# Altium project HU_MAIN_PCB_revA.PrjPcb
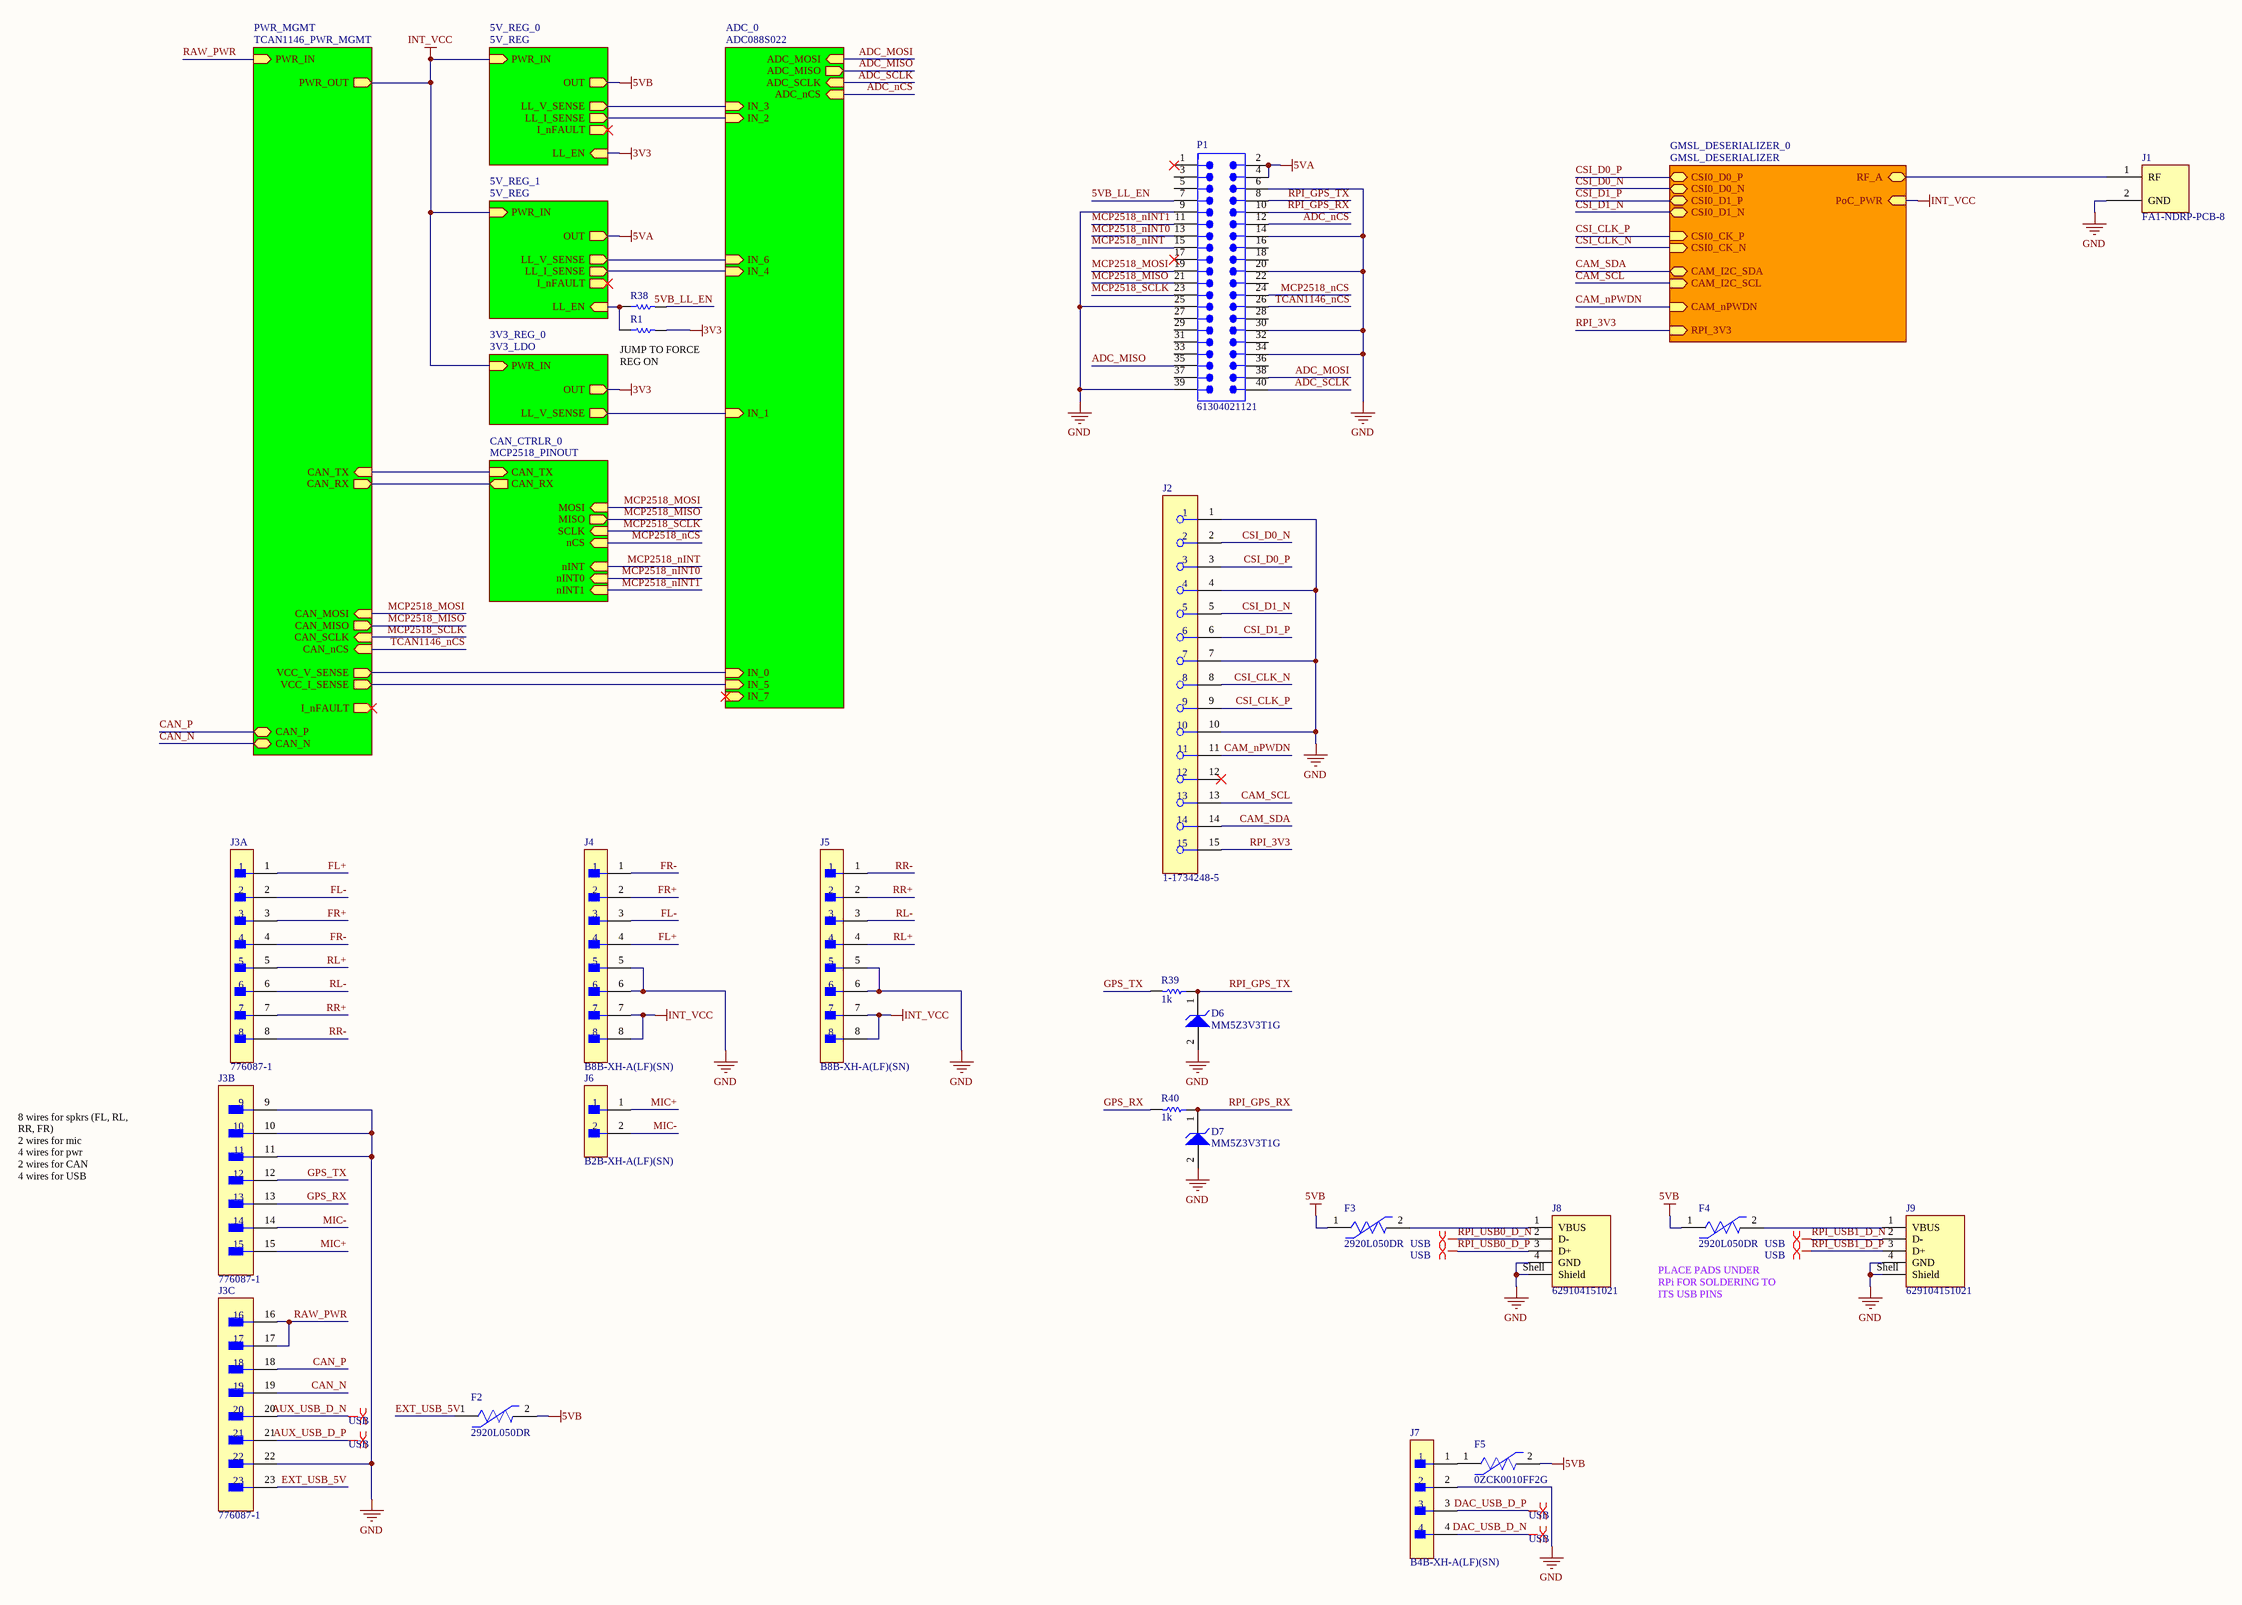
[diagram p0: HU_MAIN_PCB_revA.SchDoc]
6 sheets, 113 parts. Net scope: hierarchical (ports join the sheet entries above them; power ports are global).
Board file: HU_MAIN_PCB_revA.PcbDoc
Sheets:
  HU_MAIN_PCB_revA.SchDoc
    PWR_MGMT = TCAN1146_PWR_MGMT.SchDoc
    5V_REG_0 = 5V_REG.SchDoc
    5V_REG_1 = 5V_REG.SchDoc
    CAN_CTRLR_0 = MCP2518_PINOUT.SchDoc
    ADC_0 = ADC088S022.SchDoc
    3V3_REG_0 = 3V3_LDO.SchDoc

## Sheet HU_MAIN_PCB_revA.SchDoc
size C; SheetNumber: 1; SheetTotal: 7

### Parts
D6  MM5Z3V3T1G  [ONSC-SOD-523-2-502-01_V]
D7  MM5Z3V3T1G  [ONSC-SOD-523-2-502-01_V]
F2  2920L050DR  [FP-2920L050DR-MFG]
F3  2920L050DR  [FP-2920L050DR-MFG]
F4  2920L050DR  [FP-2920L050DR-MFG]
F5  0ZCK0010FF2G  [FP-0ZCK0010FF2G-MFG]
J1  FA1-NDRP-PCB-8  [FA1-NDRP-PCB-8-Footprint-1]
J2  1-1734248-5  [FP-1-1734248-5-MFG]
J3  776087-1  [FP-776087-1-MFG]  (parts A,B,C of 3)
J4  B8B-XH-A(LF)(SN)  [FP-B8B-XH-A_LF_SN-MFG]
J5  B8B-XH-A(LF)(SN)  [FP-B8B-XH-A_LF_SN-MFG]
J6  B2B-XH-A(LF)(SN)  [FP-B2B-XH-A_LF_SN-MFG]
J7  B4B-XH-A(LF)(SN)  [FP-B4B-XH-A_LF_SN-MFG]
J8  629104151021  [629104151021]
J9  629104151021  [629104151021]
P1  61304021121  [61304021121]
R1  DNP  [RESC1005X40X25ML05T05]  (value not drawn)
R38  DNP  [RESC1005X40X25ML05T05]  (value not drawn)
R39  1k  [R0603B]
R40  1k  [R0603B]

### Sub-sheets
3V3_REG_0 = 3V3_LDO: PWR_IN (in), OUT (out), LL_V_SENSE (out)
5V_REG_0 = 5V_REG: PWR_IN (in), LL_EN (in), OUT (out), LL_V_SENSE (out), LL_I_SENSE (out), I_nFAULT (out)
5V_REG_1 = 5V_REG: PWR_IN (in), LL_EN (in), OUT (out), LL_V_SENSE (out), LL_I_SENSE (out), I_nFAULT (out)
ADC_0 = ADC088S022: ADC_MOSI (in), ADC_MISO (out), ADC_SCLK (in), ADC_nCS (in), IN_0 (in), IN_1 (in), IN_2 (in), IN_3 (in), IN_4 (in), IN_5 (in), IN_6 (in), IN_7 (in)
CAN_CTRLR_0 = MCP2518_PINOUT: CAN_TX (in), CAN_RX (out), MOSI (in), MISO (out), SCLK (in), nCS (in), nINT (in), nINT0 (in), nINT1 (in)
GMSL_DESERIALIZER_0 = GMSL_DESERIALIZER (file not in this document): CSI0_D0_P (bidir), CSI0_D0_N (bidir), CSI0_D1_P (bidir), CSI0_D1_N (bidir), CSI0_CK_P (in), CSI0_CK_N (in), CAM_I2C_SDA (bidir), CAM_I2C_SCL (in), PoC_PWR (in), CAM_nPWDN (in), RF_A (bidir), RPI_3V3 (in)
PWR_MGMT = TCAN1146_PWR_MGMT: PWR_IN (in), PWR_OUT (out), CAN_SCLK (in), CAN_MISO (out), CAN_MOSI (in), CAN_nCS (in), VCC_V_SENSE (out), VCC_I_SENSE (out), I_nFAULT (out), CAN_P (bidir), CAN_N (bidir), CAN_TX (in), CAN_RX (out)

### Nets
3V3: R1.2 ; sheet 5V_REG_0/LL_EN, sheet 3V3_REG_0/OUT
5VA: P1.2 P1.4 ; sheet 5V_REG_1/OUT
5VB: F2.2 F3.1 F4.1 F5.2 ; sheet 5V_REG_0/OUT
GND: D6.2(A) D7.2(A) J1.2(GND) J2.1 J2.4 J2.7 J2.10 J3.9 J3.10 J3.11 J3.22 J4.5 J4.6 J5.5 J5.6 J7.2 J8.4(GND) J8.Shell(Shield) J9.4(GND) J9.Shell(Shield) P1.6 P1.9 P1.14 P1.20 P1.25 P1.30 P1.34 P1.39
INT_VCC: J4.7 J4.8 J5.7 J5.8 ; sheet PWR_MGMT/PWR_OUT, sheet 5V_REG_0/PWR_IN, sheet 5V_REG_1/PWR_IN, sheet GMSL_DESERIALIZER_0/PoC_PWR, sheet 3V3_REG_0/PWR_IN
5VB_LL_EN: P1.7 R38.2
ADC_MISO: P1.35 ; sheet ADC_0/ADC_MISO
ADC_MOSI: P1.38 ; sheet ADC_0/ADC_MOSI
ADC_nCS: P1.12 ; sheet ADC_0/ADC_nCS
ADC_SCLK: P1.40 ; sheet ADC_0/ADC_SCLK
AUX_USB_D_N: J3.20
AUX_USB_D_P: J3.21
CAM_nPWDN: J2.11 ; sheet GMSL_DESERIALIZER_0/CAM_nPWDN
CAM_SCL: J2.13 ; sheet GMSL_DESERIALIZER_0/CAM_I2C_SCL
CAM_SDA: J2.14 ; sheet GMSL_DESERIALIZER_0/CAM_I2C_SDA
CAN_N: J3.19 ; sheet PWR_MGMT/CAN_N
CAN_P: J3.18 ; sheet PWR_MGMT/CAN_P
CAN_RX: sheet PWR_MGMT/CAN_RX, sheet CAN_CTRLR_0/CAN_RX
CAN_TX: sheet PWR_MGMT/CAN_TX, sheet CAN_CTRLR_0/CAN_TX
CSI_CLK_N: J2.8 ; sheet GMSL_DESERIALIZER_0/CSI0_CK_N
CSI_CLK_P: J2.9 ; sheet GMSL_DESERIALIZER_0/CSI0_CK_P
CSI_D0_N: J2.2 ; sheet GMSL_DESERIALIZER_0/CSI0_D0_N
CSI_D0_P: J2.3 ; sheet GMSL_DESERIALIZER_0/CSI0_D0_P
CSI_D1_N: J2.5 ; sheet GMSL_DESERIALIZER_0/CSI0_D1_N
CSI_D1_P: J2.6 ; sheet GMSL_DESERIALIZER_0/CSI0_D1_P
DAC_USB_D_N: J7.4
DAC_USB_D_P: J7.3
EXT_USB_5V: F2.1 J3.23
FL+: J3.1 J4.4
FL-: J3.2 J4.3
FR+: J3.3 J4.2
FR-: J3.4 J4.1
GPS_RX: J3.13 R40.2
GPS_TX: J3.12 R39.2
MCP2518_MISO: P1.21 ; sheet PWR_MGMT/CAN_MISO, sheet CAN_CTRLR_0/MISO  [project net CAN_MISO]
MCP2518_MOSI: P1.19 ; sheet PWR_MGMT/CAN_MOSI, sheet CAN_CTRLR_0/MOSI  [project net CAN_MOSI]
MCP2518_nCS: P1.24 ; sheet CAN_CTRLR_0/nCS
MCP2518_nINT: P1.15 ; sheet CAN_CTRLR_0/nINT
MCP2518_nINT0: P1.13 ; sheet CAN_CTRLR_0/nINT0
MCP2518_nINT1: P1.11 ; sheet CAN_CTRLR_0/nINT1
MCP2518_SCLK: P1.23 ; sheet PWR_MGMT/CAN_SCLK, sheet CAN_CTRLR_0/SCLK  [project net CAN_SCLK]
MIC+: J3.15 J6.1
MIC-: J3.14 J6.2
RAW_PWR: J3.16 J3.17 ; sheet PWR_MGMT/PWR_IN
RL+: J3.5 J5.4
RL-: J3.6 J5.3
RPI_3V3: J2.15 ; sheet GMSL_DESERIALIZER_0/RPI_3V3
RPI_GPS_RX: D7.1(K) P1.10 R40.1
RPI_GPS_TX: D6.1(K) P1.8 R39.1
RPI_USB0_D_N: J8.2(D-)
RPI_USB0_D_P: J8.3(D+)
RPI_USB1_D_N: J9.2(D-)
RPI_USB1_D_P: J9.3(D+)
RR+: J3.7 J5.2
RR-: J3.8 J5.1
TCAN1146_nCS: P1.26 ; sheet PWR_MGMT/CAN_nCS  [project net CAN_nCS]
NetF3_2: F3.2 J8.1(VBUS)
NetF4_2: F4.2 J9.1(VBUS)
NetF5_1: F5.1 J7.1
NetJ1_1: J1.1(RF) ; sheet GMSL_DESERIALIZER_0/RF_A
NetR1_1: R1.1 R38.1 ; sheet 5V_REG_1/LL_EN
NetR4_5V_REG_0_1: sheet 5V_REG_0/LL_V_SENSE, sheet ADC_0/IN_3
NetR4_5V_REG_1_1: sheet 5V_REG_1/LL_V_SENSE, sheet ADC_0/IN_6
NetR27_1: sheet PWR_MGMT/VCC_V_SENSE, sheet ADC_0/IN_0
NetR36_1: sheet ADC_0/IN_1, sheet 3V3_REG_0/LL_V_SENSE
NetU2_5V_REG_0_7: sheet 5V_REG_0/LL_I_SENSE, sheet ADC_0/IN_2
NetU2_5V_REG_1_7: sheet 5V_REG_1/LL_I_SENSE, sheet ADC_0/IN_4
NetU7_7: sheet PWR_MGMT/VCC_I_SENSE, sheet ADC_0/IN_5

Not connected (* = marked no-connect by the designer): J2 12*; P1 1* 3 5 16 17* 18 22 27 28 29 31 32 33 36 37

### Layout directives
differential pair; differential pair class USB: AUX_USB_D_N, AUX_USB_D_P, DAC_USB_D_N, DAC_USB_D_P, RPI_USB0_D_N, RPI_USB0_D_P, RPI_USB1_D_N, RPI_USB1_D_P

### Notes on the sheet
- (near R1) JUMP TO FORCE REG ON
- 8 wires for spkrs (FL, RL, RR, FR)
  2 wires for mic
  4 wires for pwr
  2 wires for CAN
  4 wires for USB
- (near F4) PLACE PADS UNDER RPi FOR SOLDERING TO ITS USB PINS

### Library data of the parts
D6 D7 = CMP-1060-00750-1: Zener Voltage Regulator, 500 mW, 2-Pin SOD-523, Pb-Free, Tape and Reel; Manufacturer: On Semiconductor; P Max (W): 0.5; VZ Typ (V): 3.3; RoHS: Pb-Free; ComponentLink2Description: Datasheet; PackageReference: SOD-523-2-502-01; DatasheetVersion: Rev. 10; ComponentLink1Description: Manufacturer URL; PackageVersion: Rev. E, 09/2010; ComponentLink3URL: http://www.onsemi.com/pub_link/Collateral/502-01.PDF; ComponentLink2URL: http://www.onsemi.cn/pub_link/Collateral/MM5Z2V4T1-D.PDF; Mounting Technology: Surface Mount; PartNumber: MM5Z3V3T1G; Packing: Tape and Reel; PackageDescription: 2-Pin SOD, Body 1.2 x 0.8 mm; ComponentLink1URL: http://www.onsemi.com/; ComponentLink3Description: Package Specification
F2-F4 = CMP-08606-000071-1: PTC RESET FUSE 60V 500MA 2920; Resistance: 1.4R; Trip Current: 1A; Power Dissipation: 1.5W; Time to Trip: 4s; Approvals: cULus; Current Rating: 10A; Operating Supply Voltage: 60V; Termination: SMD/SMT; Width: 5.44mm; Case/Package: 2920; Series: 2920L; Case Code (Imperial): 2920; Height: 1.25mm; Hold Current: 500mA; Terminal Material: Copper; Min Operating Temperature: -40°C; Package Quantity: 1500; Max Voltage Rating (DC): 60V; RoHS Compliant: Yes; Case Code (Metric): 7351; Lead Free: Lead Free; Max Operating Temperature: 85°C; Voltage Rating (DC): 60V; Working Voltage: 60V; Length: 7.98mm; REACH SVHC: No SVHC; Max Current Rating: 10A; Voltage Rating: 60V; Packaging: Tape and Reel
F5 = CMP-16043-000017-1: PTC RESET FUSE 15V 100MA 0805; Max Current Rating: 100A; Trip Current: 300mA; Time to Trip: 1.5s; Lead Free: Lead Free; Case/Package: 0805; Package Quantity: 1; Hold Current: 100mA; Case Code (Metric): 2012; Packaging: Tape and Reel; Case Code (Imperial): 0805; RoHS Compliant: Yes
J1 = CMP-002-00054-1: RF F Connector, Male, Board Mount, Solder Terminal, Plug; Connector Type: RF F CONNECTOR; RoHS Compliant: Yes; Mounting Technology: Board
J2 = CMP-03368-000001-1: CONN FPC VERT 15POS 1.00MM SMD; Manufacturer: TE; Conn Orientation: Vertical; Conn Gender: Female; Current Rating: 1A; Is Female: yes; Number Of Contacts: 15; Pitch: 1mm; Voltage Rating: 125V; ComponentLink2URL: https://www.te.com/commerce/DocumentDelivery/DDEController?Action=showdoc&DocId=Customer+Drawing%7F1734248%7FE1%7Fpdf%7FEnglish%7FENG_CD_1734248_E1__.pdf%7F1-1734248-5; Device Class L1: Connectors; Category: Conn; Package: 0; Lead Free: Yes; Digikey Description: CONN FPC VERT 15POS 1.00MM SMD; Height: 8mm; Manufacturer Part Number: 1-1734248-5; Temperature: -20°C to +85°C; Contact Material: Gold,Nickel; Device Class L3: unset; ComponentLink2Description: Datasheet; RoHS: TRUE; Temperature Range Low: -20°C; Octopart: https://octopart.com/1-1734248-5-te+connectivity-40620898; Device Class L2: FFC / FPC; Mouser Description: FFC & FPC Connectors 15P 1.0 FPC, Zip V/T SMT; Automotive: No; Temperature Range High: +85°C; Mounting Type: Surface Mount
J3 = CMP-03369-000157-2: CONN HEADER R/A 23POS 4MM; Max Voltage Rating (AC): 250V; PCB Thickness: 0.062inch; PCB Mount Alignment: Yes (With); Primary Type: Rectangular; Number of Signal Positions: 23; Row Spacing: 0.157inch; Current Rating: 17A; Connector System: Wire-to-Device; Number of Ports: 1; Shielding: Unshielded; PCB Mount Retention: With; Circuit Application: Power; Tab Thickness: 1.3mm; Gender: Male; Contact Shape: Circular; Mount: Through Hole; ELV: Compliant; Orientation: Right Angle; Lead Free: Lead Free; Contact Plating: Tin; Package Quantity: 1; RoHS Compliant: Yes; Connector Type: Header; Series: Ampseal; Termination: Solder; Voltage Rating (AC): 250V; Contact Material: Brass; Number of Rows: 3; Depth: 37.9mm; Housing Material: Polybutylene; Fastening Type: Ramp; Width: 37.9mm; Flammability Rating: UL94 V-0; Housing Color: Black; Radiation Hardening: No; Contact Type: Male Pin; Sealable: Yes (With); Length: 60.8mm; Max Operating Temperature: 221°C; Packaging: Bulk; Number of Positions: 23; Insulation Material: PBT; Pitch: 0.157inch; Contact Finish - Mating: TIN; Color: Black; Number of Terminals/Pins: 23; Insulation Color: Black; Number of Contacts: 23; Min Operating Temperature: -40°C
J4 J5 = CMP-17438-000015-1: CONN HEADER VERT 8POS 2.5MM; Voltage Rating (AC): 250V; Insulation Resistance: 1GR; Connector Type: Male Pin; Max Current Rating: 3A; Wire/Cable Gauge: 22AWG; Number of Contacts: 8; Contact Resistance: 20mR; Orientation: Straight; Pitch: 2.5mm; Min Operating Temperature: -25°C; Number of Rows: 1; Contact Type: Male Pin; Packaging: Bulk; Lead Free: Lead Free; Max Operating Temperature: 85°C; Housing Material: Polyamide; Voltage Rating: 250V; Series: XH; Mount: Through Hole; Depth: 5.75mm; Contact Material: Brass; Fastening Type: Detent; Color: Natural; Max Voltage Rating (AC): 250V; Number of Positions: 8; Housing Color: White; Contact Plating: Tin; Lead Pitch: 2.5mm; Length: 22.4mm; REACH SVHC: No SVHC; Termination: Press-Fit; Current Rating: 3A
J6 = CMP-2000-05888-3: CONN HEADER VERT 2POS 2.5MM; Current Rating: 3A; Voltage Rating: 250V; Number of Contacts: 2; Contact Resistance: 20mR; Wire/Cable Gauge: 22AWG; Insulation Resistance: 1GR; Connector Type: Male Pin; Packaging: Bulk; Contact Material: Brass; Lead Free: Lead Free; Orientation: Straight; Contact Plating: Tin; Max Current Rating: 3A; Termination: Solder; Fastening Type: Detent; Depth: 5.75mm; Housing Material: Polyamide; REACH SVHC: No SVHC; Series: XH; Voltage Rating (AC): 250V; Number of Positions: 2; Color: Natural; Contact Type: Male Pin; Max Voltage Rating (DC): 250V; Pitch: 2.5mm; Lead Pitch: 2.5mm; Mount: Through Hole; Max Operating Temperature: 85°C; Length: 7.4mm; Max Voltage Rating (AC): 250V; Min Operating Temperature: -25°C; Number of Rows: 1; Housing Color: White
J7 = CMP-17439-000250-1: CONN HEADER VERT 4POS 2.5MM; Number of Contacts: 4; Contact Resistance: 20mR; Voltage Rating: 250V; Max Current Rating: 3A; Gender: Male; Wire/Cable Gauge: 22AWG; Mated Stacking Heights: 9.8mm; Insulation Resistance: 1GR; Orientation: Straight; Contact Type: Male Pin; Contact Finish - Mating: TIN; Series: XH; Max Voltage Rating (AC): 250V; Lead Pitch: 2.5mm; Contact Shape: Square; Insulation Color: Natural; Termination: Solder; Lead Free: Lead Free; Voltage Rating (AC): 250V; Number of Rows: 1; Flammability Rating: UL94 V-0; Number of Positions: 4; Max Operating Temperature: 85°C; Package Quantity: 500; Mount: Through Hole; REACH SVHC: No SVHC; Connector Type: Header; Insulation Material: Nylon; Fastening Type: Detent; Min Operating Temperature: -25°C; Housing Color: White; Packaging: Bulk; Contact Plating: Tin; Contact Material: Brass; Max Voltage Rating (DC): 250V; Housing Material: Polyamide; Color: Natural; Material: Polyamide; Pitch: 2.5mm; Depth: 5.75mm; Current Rating: 3A; Length: 12.4mm
J8 J9 = CMP-1502-03241-3: NexarPartId: 52645112; USB Standard: USB 2.0; Insulation Resistance: 1GΩ; Current Rating: 1.5A; Number of Contacts: 4; Contact Resistance: 30mΩ; Gender: Receptacle; Connector Type: USB; Operating Supply Voltage: 30V; Mount: Horizontal, Surface Mount; RoHS: Compliant; Max Operating Temperature: 85°C; Min Operating Temperature: -40°C; Contact Plating: Gold; Contact Material: Gold, Nickel; Number of Pins: 4; Packaging: Tape and Reel; Height: 7.2mm; Orientation: Horizontal; Voltage Rating: 30V; Termination: SMD/SMT; Features: Shielded; REACH SVHC: Unknown
P1 = CMP-1502-01135-3: NexarPartId: 32855579; Pitch: 2.54mm; Operating Supply Voltage: 250V; Gender: Male; Number of Positions: 40; Current Rating: 3A; Contact Resistance: 20mΩ; Connector Type: Male Pin; Color: Black; Contact Plating: Gold; Contact Material: Copper; Number of Rows: 2; Row Spacing: 2.54mm; Mount: Through Hole; RoHS: Compliant; Contact Mating Length: 5.9944mm; Voltage Rating: 250V; Orientation: Vertical; Max Operating Temperature: 105°C; REACH SVHC: Unknown; Min Operating Temperature: -40°C; Lead Pitch: 2.54mm; Height: 8.89mm; Termination: Solder; Number of Pins: 40; Number of Contacts: 40; Packaging: Bulk
R1 R38 = CMP-009-00118-2: READ THE NAME; Pins: 2; Component Type: Standard; Design Item ID: CMP-009-00206-2; Source: 0402jump.SchLib
R39 R40 = CMP-009-00002-14: Resistor

## Sheet TCAN1146_PWR_MGMT.SchDoc
size C; SheetNumber: 5; SheetTotal: 7
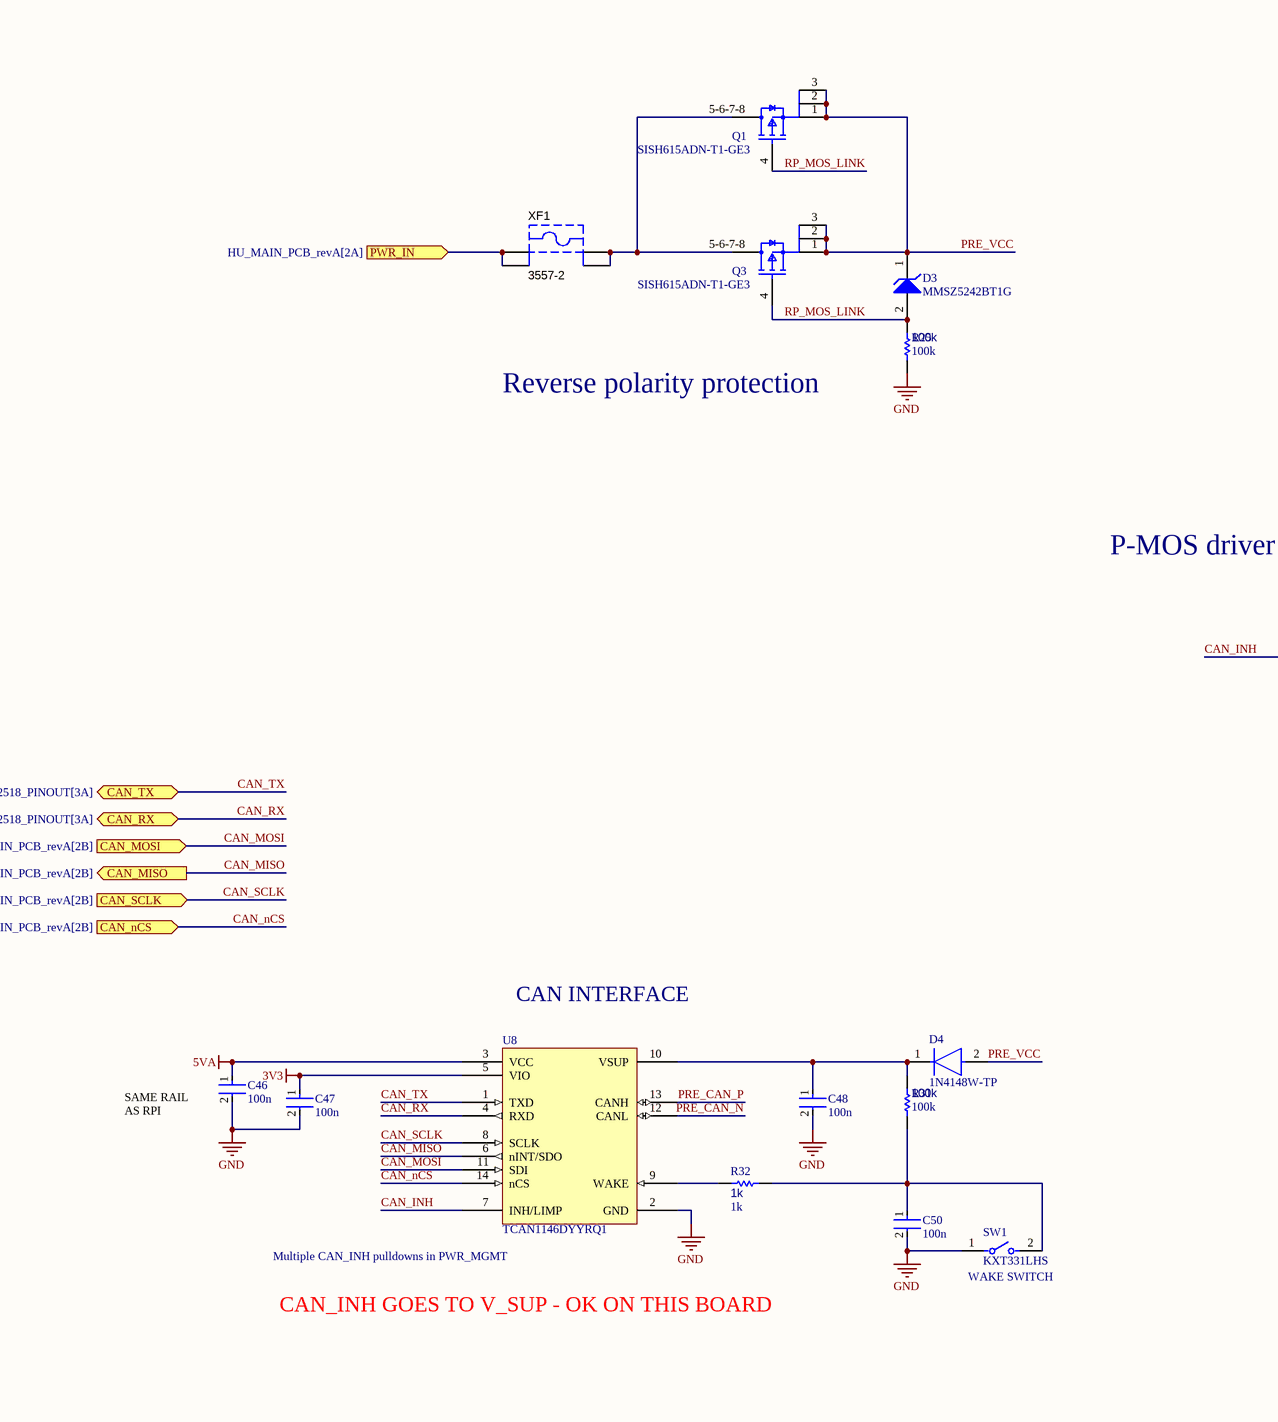
[diagram p1: TCAN1146_PWR_MGMT.SchDoc, left]
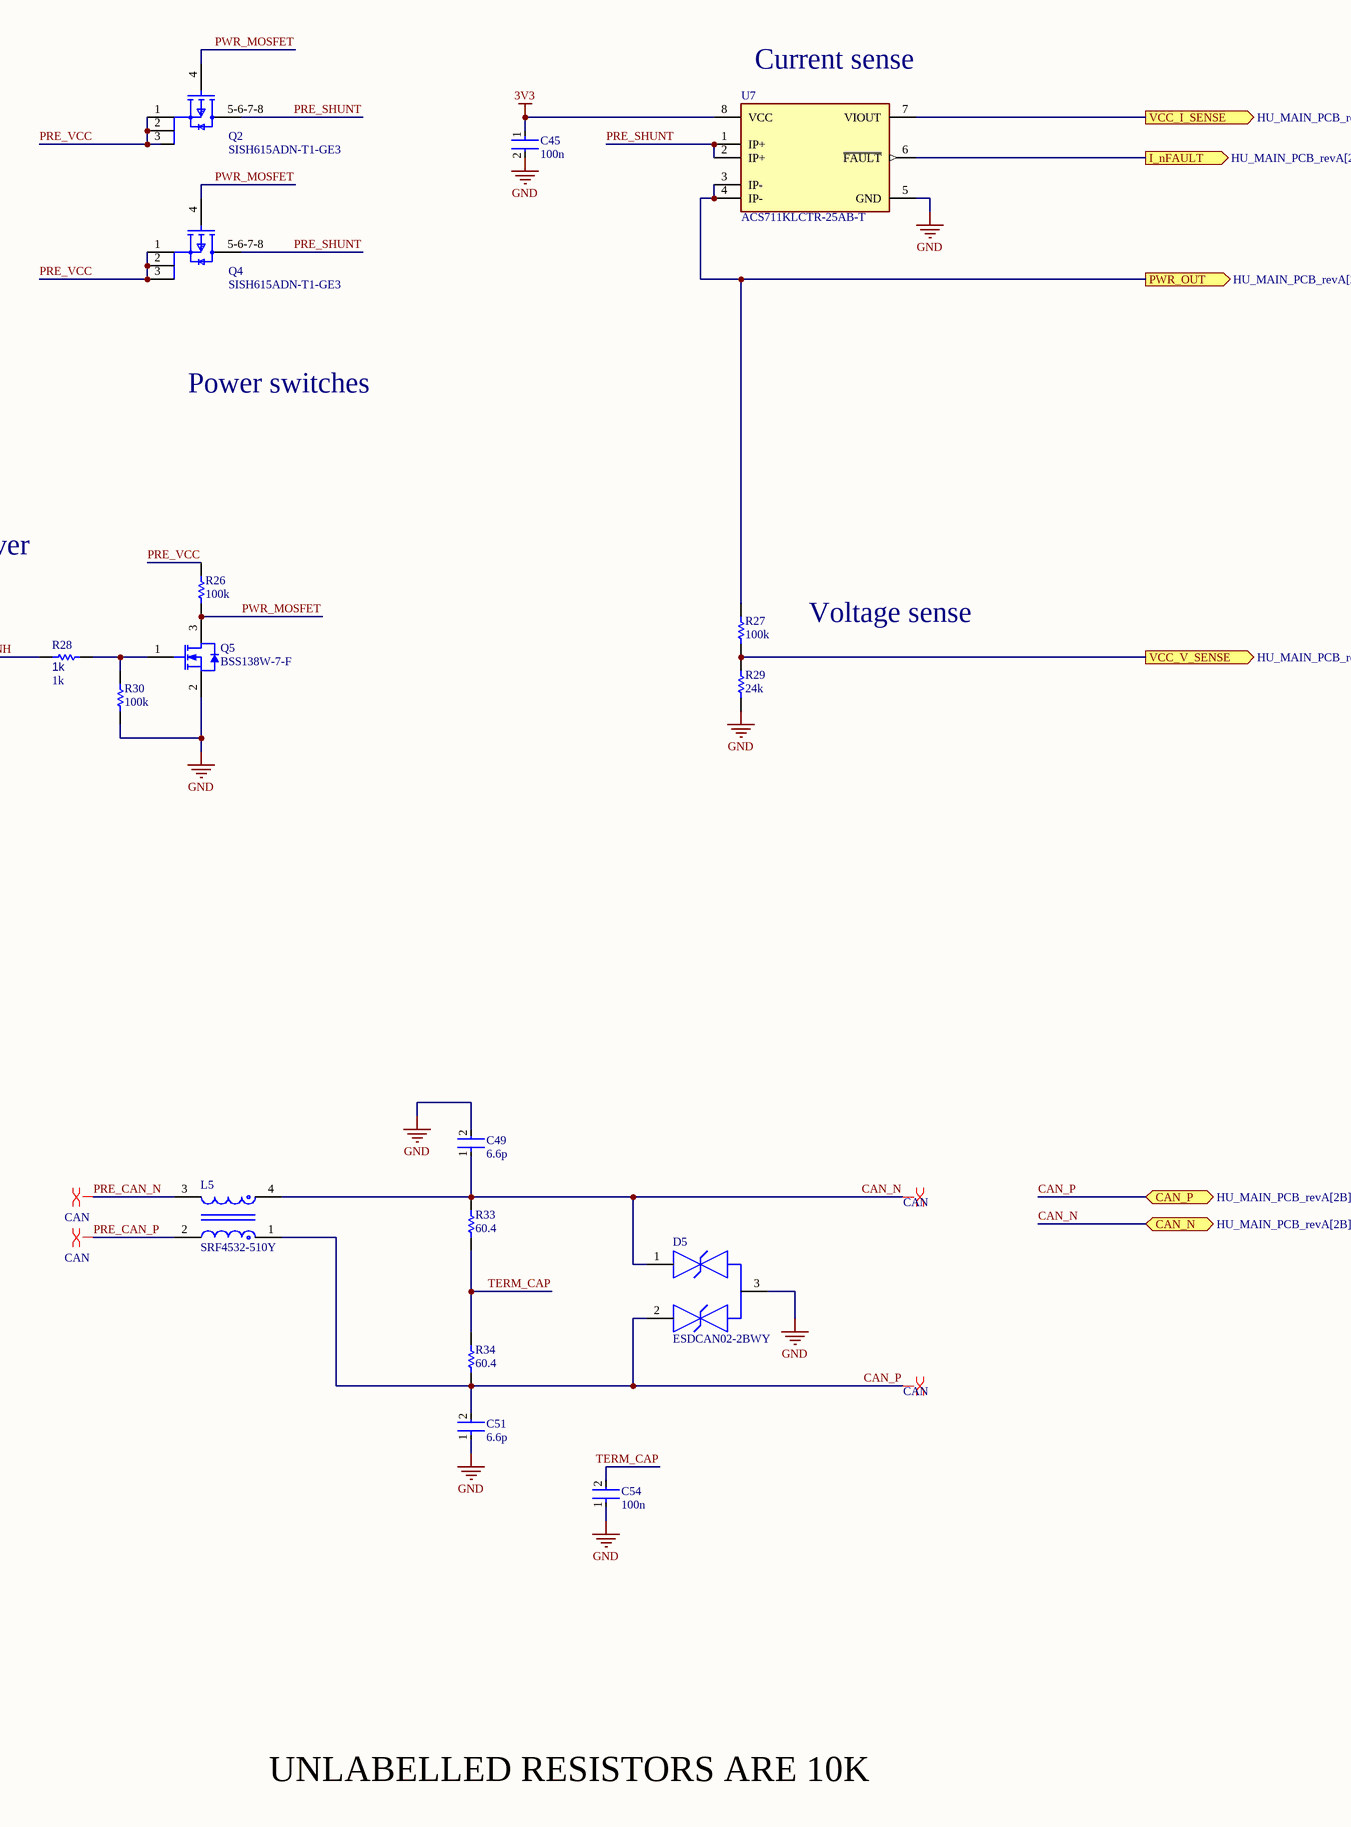
[diagram p2: TCAN1146_PWR_MGMT.SchDoc, right]

### Parts
C45  100n  [FP-0402-L_1_0_0_05-W_0_5-IPC_A]
C46  100n  [FP-0402-L_1_0_0_05-W_0_5-IPC_A]
C47  100n  [FP-0402-L_1_0_0_05-W_0_5-IPC_A]
C48  100n  [FP-0402-L_1_0_0_05-W_0_5-IPC_A]
C49  6.6p  [FP-0402-L_1_0_0_05-W_0_5-IPC_A]
C50  100n  [FP-0402-L_1_0_0_05-W_0_5-IPC_A]
C51  6.6p  [FP-0402-L_1_0_0_05-W_0_5-IPC_A]
C54  100n  [FP-0402-L_1_0_0_05-W_0_5-IPC_A]
D3  MMSZ5242BT1G  [ONSC-SOD-123-2-425-04_V]
D4  1N4148W-TP  [FP-SOD-123-IPC_A]
D5  ESDCAN02-2BWY  [FP-SOT323-3L-MFG]
L5  SRF4532-510Y  [FP-SRF4532-MFG]
Q1  SISH615ADN-T1-GE3  [SISH615ADN-T1-GE3-Footprint-1]
Q2  SISH615ADN-T1-GE3  [SISH615ADN-T1-GE3-Footprint-1]
Q3  SISH615ADN-T1-GE3  [SISH615ADN-T1-GE3-Footprint-1]
Q4  SISH615ADN-T1-GE3  [SISH615ADN-T1-GE3-Footprint-1]
Q5  BSS138W-7-F  [DIOD-SOT323-3_V]
R25  100k  [R0603B]
R26  100k  [R0603B]
R27  100k  [R0603B]
R28  1k  [R0603B]
R29  24k  [R0603B]
R30  100k  [R0603B]
R31  100k  [R0603B]
R32  1k  [R0603B]
R33  60.4  [R0603B]
R34  60.4  [R0603B]
SW1  KXT331LHS  [FP-KXT331LHS-MFG]
U7  ACS711KLCTR-25AB-T  [FP-LC-8-IPC_A]
U8  TCAN1146DYYRQ1  [TCAN1146DYYRQ1-Footprint-1]
XF1  3557-2  [KSTN-3557-2]

### Ports
CAN_MISO (out, see HU_MAIN_PCB_revA[2B]), CAN_MOSI (in, see HU_MAIN_PCB_revA[2B]), CAN_N (bidir, see HU_MAIN_PCB_revA[2B]), CAN_nCS (in, see HU_MAIN_PCB_revA[2B]), CAN_P (bidir, see HU_MAIN_PCB_revA[2B]), CAN_RX (bidir, see HU_MAIN_PCB_revA[2B], MCP2518_PINOUT[3A]), CAN_SCLK (in, see HU_MAIN_PCB_revA[2B]), CAN_TX (bidir, see HU_MAIN_PCB_revA[2B], MCP2518_PINOUT[3A]), I_nFAULT (out, see HU_MAIN_PCB_revA[2B]), PWR_IN (in, see HU_MAIN_PCB_revA[2A]), PWR_OUT (out, see HU_MAIN_PCB_revA[2A]), VCC_I_SENSE (out, see HU_MAIN_PCB_revA[2B]), VCC_V_SENSE (out, see HU_MAIN_PCB_revA[2B])

### Nets
3V3: C45.1 C47.1 U7.8(VCC) U8.5(VIO)
5VA: C46.1 U8.3(VCC)
GND: C45.2 C46.2 C47.2 C48.2 C49.2 C50.2 C51.1 C54.1 D5.3 Q5.2(S) R25.1 R29.1 R30.1 SW1.1 U7.5(GND) U8.2(GND)
INT_VCC: R27.2 U7.3(IP-) U7.4(IP-) ; port PWR_OUT
CAN_INH: R28.1 U8.7(INH/LIMP)
CAN_MISO: U8.6(nINT/SDO) ; port CAN_MISO
CAN_MOSI: U8.11(SDI) ; port CAN_MOSI
CAN_N: C49.1 D5.1 L5.4 R33.2 ; port CAN_N
CAN_nCS: U8.14(nCS) ; port CAN_nCS
CAN_P: C51.2 D5.2 L5.1 R34.1 ; port CAN_P
CAN_RX: U8.4(RXD) ; port CAN_RX
CAN_SCLK: U8.8(SCLK) ; port CAN_SCLK
CAN_TX: U8.1(TXD) ; port CAN_TX
PRE_CAN_N: L5.3 U8.12(CANL)
PRE_CAN_P: L5.2 U8.13(CANH)
PRE_SHUNT: Q2.5-6-7-8(D) Q4.5-6-7-8(D) U7.1(IP+) U7.2(IP+)
PRE_VCC: D3.1(K) D4.2(A) Q1.1(S) Q1.2(S) Q1.3(S) Q2.1(S) Q2.2(S) Q2.3(S) Q3.1(S) Q3.2(S) Q3.3(S) Q4.1(S) Q4.2(S) Q4.3(S) R26.2
PWR_MOSFET: Q2.4(G) Q4.4(G) Q5.3(D) R26.1
RAW_PWR: XF1.1 XF1.2 ; port PWR_IN
RP_MOS_LINK: D3.2(A) Q1.4(G) Q3.4(G) R25.2
TERM_CAP: C54.2 R33.1 R34.2
NetC48_1: C48.1 D4.1(C) R31.2 U8.10(VSUP)
NetC50_1: C50.1 R31.1 R32.2 SW1.2
NetQ1_5-6-7-8: Q1.5-6-7-8(D) Q3.5-6-7-8(D) XF1.3 XF1.4
NetQ5_1: Q5.1(G) R28.2 R30.2
NetR27_1: R27.1 R29.2 ; port VCC_V_SENSE
NetR32_1: R32.1 U8.9(WAKE)
NetU7_6: U7.6(~{FAULT}) ; port I_nFAULT
NetU7_7: U7.7(VIOUT) ; port VCC_I_SENSE

### Layout directives
differential pair; differential pair class CAN: CAN_N, CAN_P, PRE_CAN_N, PRE_CAN_P

### Notes on the sheet
- (near U7) Current sense
- (near R25) Reverse polarity protection
- Power switches
- P-MOS driver
- Voltage sense
- CAN INTERFACE
- (near C46) SAME RAIL AS RPI
- (near U8) Multiple CAN_INH pulldowns in PWR_MGMT
- (near SW1) WAKE SWITCH
- CAN_INH GOES TO V_SUP - OK ON THIS BOARD
- UNLABELLED RESISTORS ARE 10K

### Library data of the parts
C45-C51 C54 = CMP-001-00058-1: LARGE PADS, 0402 CAP, CHANGE COMMENT TO MATCH REAL P/N; Capacitor Type: Ceramic; Min Operating Temperature: -55°C; Mounting Technology: Surface Mount; Pins: 2; Case/Package: 0402; RoHS Compliant: Yes; Max Operating Temperature: 85°C
D3 = CMP-1060-00565-1: Zener Voltage Regulator, 500 mW, 2-Pin SOD-123, Pb-Free, Tape and Reel; Manufacturer: On Semiconductor; P Max (W): 0.5; VZ Typ (V): 12; PartNumber: MMSZ5242BT1G; PackageReference: SOD-123-2-425-04; ComponentLink3URL: http://www.onsemi.com/pub_link/Collateral/425-04.PDF; Mounting Technology: Surface Mount; ComponentLink2Description: Datasheet; ComponentLink1URL: http://www.onsemi.com/; ComponentLink3Description: Package Specification; PackageDescription: 2-Pin SOD, Body 1.6 x 2.69 mm; PackageVersion: Rev. G, 10/2009; ComponentLink1Description: Manufacturer URL; RoHS: Pb-Free; ComponentLink2URL: http://www.onsemi.com/pub_link/Collateral/MMSZ5221BT1-D.PDF; Packing: Tape and Reel; DatasheetVersion: Rev. 12
D4 = CMP-2000-04993-2: DIODE GEN PURP 100V 150MA SOD123; Max Reverse Leakage Current: 5uA; Max Surge Current: 2A; Reverse Recovery Time: 4ns; Polarity: Standard; Capacitance: 4pF; Max Forward Surge Current (Ifsm): 1A; Element Configuration: Single; Power Dissipation: 400mW; Forward Voltage: 1V; Radiation Hardening: No; Lead Free: Lead Free; Max Reverse Voltage (DC): 100V; Current Rating: 150mA; Forward Current: 150mA; Packaging: Tape and Reel; Number of Pins: 2; Package Quantity: 3000; Max Operating Temperature: 150°C; Min Operating Temperature: -65°C; Average Rectified Current: 150mA; Recovery Time: 4ns; Output Current: 150mA; Peak Non-Repetitive Surge Current: 2A; Width: 1.8mm; Voltage Rating (DC): 100V; Height: 1.2mm; Max Repetitive Reverse Voltage (Vrrm): 100V; Mount: Surface Mount; Length: 2.85mm
D5 = CMP-12225-000055-1: TVS DIODE 26.5V 44V SOT323-3; Manufacturer: STMicroelectronics; Value: 3pF; Direction: Bidirectional; Breakdown Voltage: 28.5V; Automotive Grade: Grade 0; Standoff Height: 0mm; Peak Pulse Power: 170W; Peak Pulse Current: 3A; Number Of Channels: 2; Max Junction Temp: +175°C; Mouser Description: TVS Diodes / ESD Suppressors Automotive dual-line Transil, Transient voltage suppressor (TVS) for CAN bus; Height: 1.1mm; Category: Diode; Reverse Standoff Voltage: 26.5V; Device Class L1: Circuit Protection; Temperature: -55°C to +175°C; RoHS: TRUE; ComponentLink2URL: https://www.st.com/resource/en/datasheet/esdcan02-2bwy.pdf; Device Class L3: unset; Device Class L2: TVS Diodes; Temperature Range High: +175°C; Octopart: https://octopart.com/esdcan02-2bwy-stmicroelectronics-58631133; Ipc Land Pattern Name: SOT65P210X95-3; Temperature Range Low: -55°C; Capacitance: 3pF; Digikey Description: TVS DIODE 26.5V 44V SOT323-3; Automotive: Yes; ComponentLink2Description: Datasheet; Clamping Voltage: 44V; Manufacturer Part Number: ESDCAN02-2BWY; Lead Free: Yes; Package: SOT323-3L
L5 = CMP-07251-000006-1: CMC 51UH 200MA 2LN 2KOHM SMD; Element Configuration: Dual; Number of Lines: 2; Core Material: Ferrite; Impedance: 2kR; Test Frequency: 100kHz; Voltage Rating (DC): 50V; Insulation Resistance: 10MR; Material: Steel; Tolerance: 50%; DC Resistance (DCR): 3.5R; RoHS Compliant: Yes; Mount: Surface Mount; REACH SVHC: No SVHC; Termination: SMD/SMT; DC Current: 200mA; Current: 200mA; Lead Free: Lead Free; Contact Plating: Tin; Length: 4.5mm; Max DC Current: 200mA; Width: 0.126inch; Case/Package: 4532; Packaging: Tape and Reel; Package Quantity: 1; Min Operating Temperature: -40°C; Depth: 3.4mm; Series: SRF4532; Max Operating Temperature: 125°C; Current Rating: 200mA; Self Resonant Frequency: 100kHz; Height: 0.118inch; Inductance: 51uH; Resistance: 2kR
Q1-Q4 = CMP-013-00018-2: Trans MOSFET P-CH 20V 22.1A 8-Pin PowerPAK 1212 EP T/R; Source: SISH615ADN-T1-GE3.SchLib; Design Item ID: CMP-013-00036-4; Component Type: Standard; Pins: 5
Q5 = CMP-2000-05968-1: N-Channel Enhancement Mode Mosfet, 50 V, 200 mA, -55 to 150 degC, 6-Pin SOT-323, RoHS, Tape and Reel; Typical Turn-Off Delay Time: 20ns; Number of Channels: 1Channel; Type: EnhancementModeFieldEffectTransistor; Brand: DiodesIncorporated; Vds - Drain-Source Breakdown Voltage: 75V; Vgs - Gate-Source Voltage: 20V; Rds On - Drain-Source Resistance: 1.4Ohms; Transistor Type: 1N-Channel; Configuration: Single; Unit Weight: 0.000212oz; Pd - Power Dissipation: 200mW; Id - Continuous Drain Current: 200mA; Forward Transconductance - Min: 0.1S; Manufacturer URL: http://www.diodes.com/; Series: BSS138; Package Description: 3-Pin Small Outline Transistor, Body 2 x 1.25 mm, Pitch 0.65 mm; Mounting Technology: SurfaceMount; Product Category: MOSFET; RoHS: True; Maximum Operating Temperature: +150C; Height: 1mm; Length: 2.2mm; Technology: Si; Width: 1.35mm; Datasheet URL: http://www.diodes.com/_files/datasheets/ds30206.pdf; Manufacturer: DiodesIncorporated; Package / Case: SOT-323-3; Typical Turn-On Delay Time: 20ns; Transistor Polarity: N-Channel; Factory Pack Quantity: 3000; Packaging: Reel; Product: MOSFETSmallSignal; Datasheet Version: Rev. 11-2, 09/2013; Package Reference: SOT323; Minimum Operating Temperature: -55C; Mounting Style: SMD/SMT; Channel Mode: Enhancement
R25-R34 = CMP-009-00002-14: Resistor
  R25-R27 R30 R31: Value: 100k
  R28 R32: Value: 1k
  R29: Value: 24k
  R33 R34: Value: 60.4
SW1 = CMP-10040-000029-1: SWITCH TACTILE SPST-NO 0.02A 15V; Operating Force: 240gf; Switch Travel: 0.13mm; Illumination Type: Non-Illuminated; Throw Configuration: SPST; Number of Ports: 1; Current Rating: 5A; Mechanical Life: 500000Cycles; Switch Function: Off-Mom; Connector Type: USB; Actuator Type: Standard; Gender: Receptacle; Number of Contacts: 24; Contact Plating: Gold; Insulation Color: Black; Min Operating Temperature: -40°C; Packaging: Tape and Reel; Flammability Rating: UL94 V-0; Max Operating Temperature: 85°C; Termination: Solder; Mount: Surface Mount
U7 = CMP-1557-00015-2: SENSOR CURRENT HALL 25A AC/DC; Bandwidth: 100kHz; Min Supply Voltage: 3V; Polarity: Bidirectional; Max Supply Voltage: 5.5V; Max Supply Current: 5.5mA; Number of Channels: 1; Quiescent Current: 4mA; Sensitivity: 55mV/A; Accuracy: 4%; Linearity: 1%; Operating Supply Voltage: 3.3V; Response Time: 4.6us; Case/Package: SOIC; Min Operating Temperature: -40°C; RoHS Compliant: Yes; Length: 4.9mm; Package Quantity: 1; Number of Pins: 8; Width: 3.9mm; REACH SVHC: No SVHC; -3db Bandwidth: 100kHz; Series: -; Packaging: Tape and Reel; Max Operating Temperature: 125°C; Current Sensing: 25A; Height: 1.5mm; Frequency: 100kHz
U8 = CMP-318-000000-2: Automotive CAN FD transceiver with watchdog, bus diagnostics and partial networking via sele 14-SOT-23-THIN -40 to 150; Component Type: Standard; Design Item ID: CMP-015-00012-2; Pin Count: 14; Source: TCAN1146DYYRQ1.SchLib
XF1 = CMP-2000-05461-1: FUSE HOLDER, PCB MOUNT, 500VAC, 20A, ROHS; Manufacturer: Keystone-Electronics; Number of Circuits: 1; Voltage: 500V; Fuseholder Type: Block; Fuse Type: Blade; Fuse Size: 0.43"Lx0.15"Wx0.64"H(10.92mmx3.81mmx16.25mm); For Use With/Related Products: ATC,ATO257,MINI897; Current Rating: 30A; Datasheet URL: http://datasheet.octopart.com/3557-2-Keystone-datasheet-15715937.pdf; Orientation: Vertical; Family: Fuseholders; Datasheet Version: Apr-13; Contact Finish: TinNickel; Mounting Type: PCB; Series: -; Category: CircuitProtection; Termination Style: PCPin; Contact Material: Brass; Manufacturer URL: http://www.keyelco.com/

## Sheet 5V_REG.SchDoc
size A4; SheetNumber: 2; SheetTotal: 7
Used 2 times, as channels 5V_REG_0, 5V_REG_1. Parts and nets are listed once, with the designators drawn on the sheet.
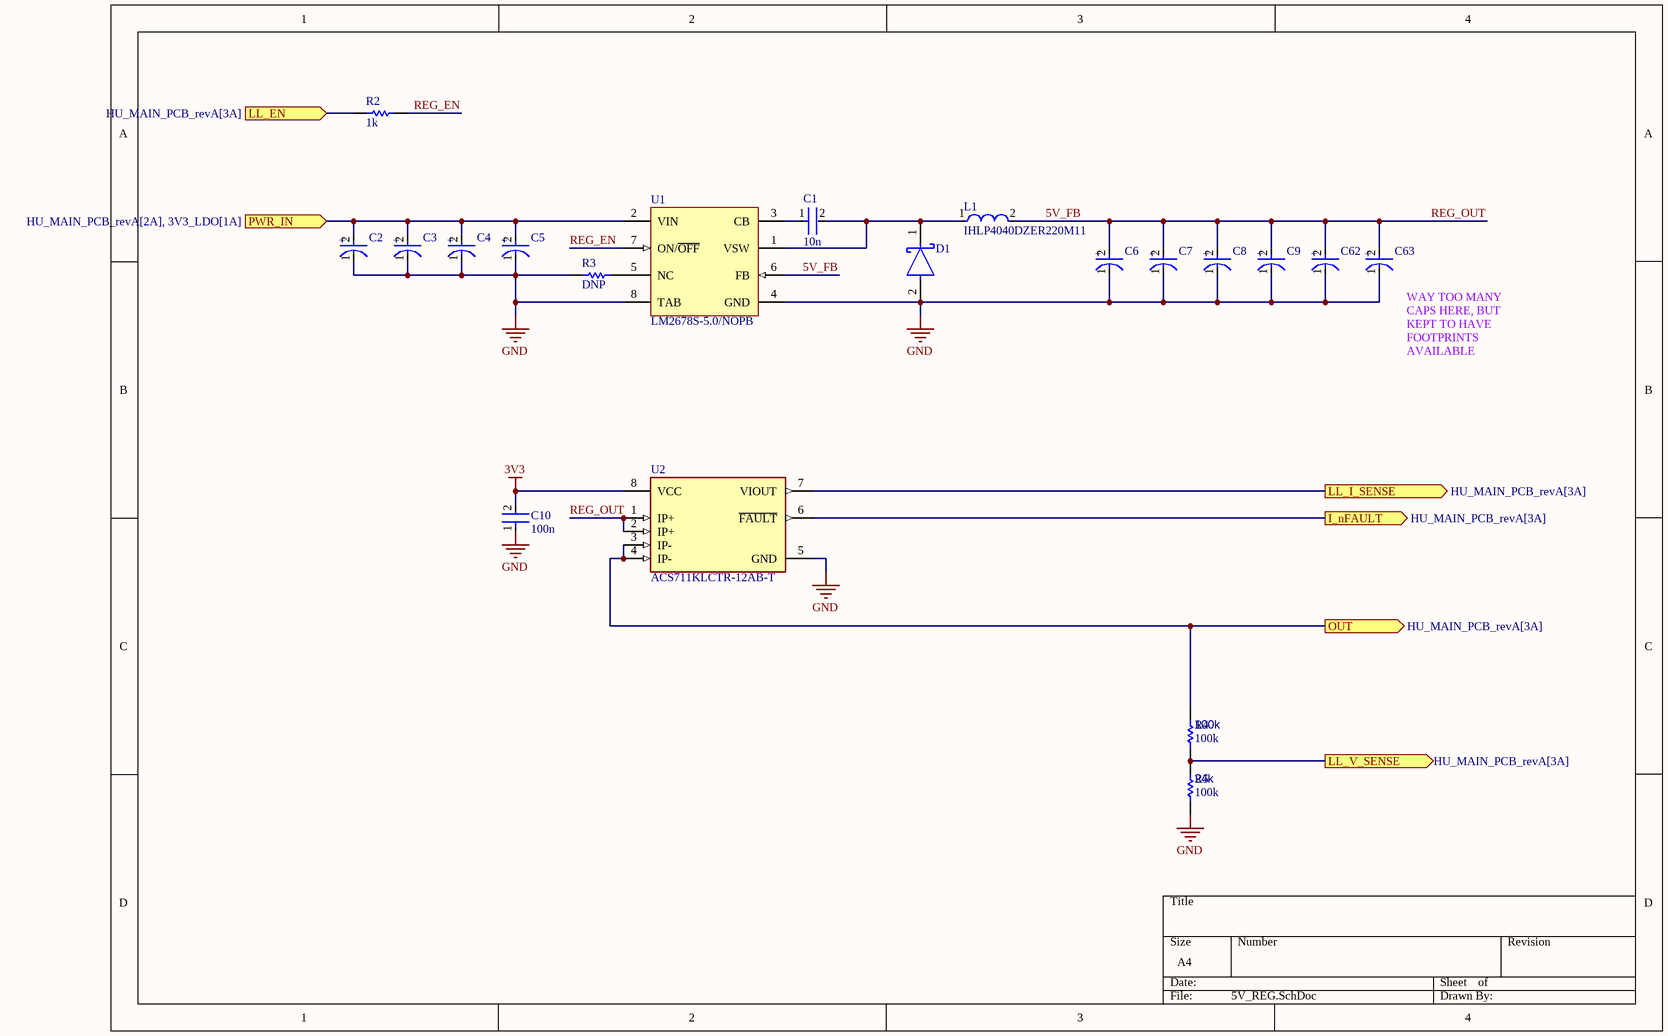
[diagram p3: 5V_REG.SchDoc]

### Parts
C1  10n  [FP-0402-L_1_0_0_05-W_0_5-IPC_A]
C2  TPSE686K025R0125  [FP-TPSE-MFG]  (value not drawn)
C3  TPSE686K025R0125  [FP-TPSE-MFG]  (value not drawn)
C4  TPSE686K025R0125  [FP-TPSE-MFG]  (value not drawn)
C5  TPSE686K025R0125  [FP-TPSE-MFG]  (value not drawn)
C6  TPSE686K025R0125  [FP-TPSE-MFG]  (value not drawn)
C7  TPSE686K025R0125  [FP-TPSE-MFG]  (value not drawn)
C8  TPSE686K025R0125  [FP-TPSE-MFG]  (value not drawn)
C9  TPSE686K025R0125  [FP-TPSE-MFG]  (value not drawn)
C10  100n  [FP-0402-L_1_0_0_05-W_0_5-IPC_A]
C62  TPSE686K025R0125  [FP-TPSE-MFG]  (value not drawn)
C63  TPSE686K025R0125  [FP-TPSE-MFG]  (value not drawn)
D1  B540C-13-F  [FP-SMC-MFG]  (value not drawn)
L1  IHLP4040DZER220M11  [FP-IHLP-4040DZ-FP_3_124x3-MFG]
R2  1k  [R0603B]
R3  DNP  [R0603B]
R4  100k  [R0603B]
R5  100k  value 24k  [R0603B]
U1  LM2678S-5.0/NOPB  [KTW0007B_L]
U2  ACS711KLCTR-12AB-T  [FP-LC-8-IPC_C]

### Ports
I_nFAULT (out, see HU_MAIN_PCB_revA[3A]), LL_EN (in, see HU_MAIN_PCB_revA[3A]), LL_I_SENSE (out, see HU_MAIN_PCB_revA[3A]), LL_V_SENSE (out, see HU_MAIN_PCB_revA[3A]), OUT (out, see HU_MAIN_PCB_revA[3A]), PWR_IN (in, see HU_MAIN_PCB_revA[2A], 3V3_LDO[1A])

### Nets
3V3: C10.2 U2.8(VCC)
GND: C2.1(C) C3.1(C) C4.1(C) C5.1(C) C6.1(C) C7.1(C) C8.1(C) C9.1(C) C10.1 C62.1(C) C63.1(C) D1.2(A) R3.2 R5.1 U1.4(GND) U1.8(TAB) U2.5(GND)
5V_FB: C6.2(A) C7.2(A) C8.2(A) C9.2(A) C62.2(A) C63.2(A) L1.2 U1.6(FB) U2.1(IP+) U2.2(IP+)  [also labelled REG_OUT]
I_nFAULT: U2.6(~{FAULT}) ; port I_nFAULT
LL_EN: R2.2 ; port LL_EN
LL_I_SENSE: U2.7(VIOUT) ; port LL_I_SENSE
LL_V_SENSE: R4.1 R5.2 ; port LL_V_SENSE
OUT: R4.2 U2.3(IP-) U2.4(IP-) ; port OUT
PWR_IN: C2.2(A) C3.2(A) C4.2(A) C5.2(A) U1.2(VIN) ; port PWR_IN
REG_EN: R2.1 U1.7(ON/~{OFF})
NetC1_1: C1.1 U1.3(CB)
NetC1_2: C1.2 D1.1(C) L1.1 U1.1(VSW)
NetR3_1: R3.1 U1.5(NC)

### Channels
5V_REG_0: designators end in _5V_REG_0; ports I_nFAULT=NetU2_5V_REG_0_6 LL_EN=3V3 LL_I_SENSE=NetU2_5V_REG_0_7 LL_V_SENSE=NetR4_5V_REG_0_1 OUT=5VB PWR_IN=INT_VCC
5V_REG_1: designators end in _5V_REG_1; ports I_nFAULT=NetU2_5V_REG_1_6 LL_EN=NetR1_1 LL_I_SENSE=NetU2_5V_REG_1_7 LL_V_SENSE=NetR4_5V_REG_1_1 OUT=5VA PWR_IN=INT_VCC

### Notes on the sheet
- (near C63) WAY TOO MANY CAPS HERE, BUT KEPT TO HAVE FOOTPRINTS AVAILABLE
- (in symbol CMP-04424-000178-1) +

### Library data of the parts
C1 C10 = CMP-001-00058-1: as C45 on sheet TCAN1146_PWR_MGMT; Min Operating Temperature: -55°C; Mounting Technology: Surface Mount; Pins: 2; Case/Package: 0402; RoHS Compliant: Yes; Max Operating Temperature: 85°C
C2-C9 C62 C63 = CMP-04424-000178-1: CAP TANT 68UF 10% 25V 2917; Leakage Current: 17uA; Dielectric Material: Tantalum; Dissipation Factor: 6%; Ripple Current: 460uA; Polarity: Polar; ESR (Equivalent Series Resistance): 125mR; Mount: Surface Mount; Voltage Rating: 25V; Min Operating Temperature: -55°C; Case Code (Imperial): 2917; RoHS Compliant: Yes; Depth: 4.3mm; Lead Free: Lead Free; Number of Pins: 2; Width: 4.3mm; Series: TPS; Radiation Hardening: No; Height - Seated (Max): 0.169inch; Capacitance: 68uF; Case Code (Metric): 7343; Length: 7.3mm; Max Operating Temperature: 125°C; Packaging: Tape and Reel; Case/Package: 2917; Package Quantity: 1; Features: General Purpose; Voltage: 25V; REACH SVHC: No SVHC; Tolerance: 10%; Voltage Rating (DC): 25V; Height: 4.1mm; Termination: SMD/SMT
D1 = CMP-2000-05097-3: DIODE SCHOTTKY 40V 5A SMC; Manufacturer: Diodes Inc.; Automotive Grade: NA; Peak Reverse Current: 0.5mA; Value: 300pF; Max Junction Temp: +150°C; Max Surge Forward Current: 100A; Standoff Height: 0.1mm; Digikey Description: DIODE SCHOTTKY 40V 5A SMC; Temperature Range Low: -55°C; Manufacturer Part Number: B540C-13-F; Octopart: https://octopart.com/b540c-13-f-diodes+inc.-325873; Lead Free: Yes; Reverse Voltage: 40V; RoHS: TRUE; Category: Diode; Mouser Description: Diode: Schottky rectifying; SMD; 40V; 5A; SMC; Package: reel, tape; ComponentLink2Description: Datasheet; Temperature Range High: +150°C; Automotive: No; Footprint Url: https://www.diodes.com/assets/Package-Files/SMC.pdf; Device Class L3: Schottky Diodes; Height: 2.5mm; Forward Current: 5A; Temperature: -55°C to +150°C; Package: SMC; ComponentLink2URL: https://www.diodes.com/assets/Datasheets/ds13012.pdf; Device Class L2: Diodes; Max Repetitive Reverse Voltage: 40V; Device Class L1: Discrete Semiconductors; Capacitance: 300pF
L1 = CMP-02424-000785-1: Commercial Inductors, Low DCR Series 22uH 5A 66mΩ 20%; Shielding: Shielded; Max DC Current: 4.5A; Test Frequency: 100kHz; DC Resistance (DCR): 66mR; Self Resonant Frequency: 1MHz; Core Material: Metal; Series: IHLP-4040DZ-11; Min Operating Temperature: -55°C; Rated Current-Max: 5A; Current Rating: 5A; Military Standard: Not; Depth: 10.3mm; Height - Seated (Max): 0.157inch; Contact Plating: Tin; Termination: SMD/SMT; Length: 0.43inch; Package Quantity: 1; Width: 0.405inch; Inductance Tolerance: 20%; Tolerance: 20%; Height: 4mm; RMS Current (Irms): 5A; Saturation Current: 4.5A; Inductance: 22uH; Mount: Surface Mount; Max Operating Temperature: 125°C; Case/Package: 4040; Packaging: Tape and Reel; Radiation Hardening: No; RoHS Compliant: Yes; Lead Free: Lead Free
R2 R4 R5 = CMP-009-00002-14: Resistor
  R2: Value: 1k
  R4: Value: 100k
R3 = CMP-009-00002-14: Resistor; Value: 1k
U1 = CMP-0069-00189-3: SIMPLE SWITCHER® High Efficiency 5A Step-Down Voltage Regulator, 7-pin TO-263, Pb-Free; Manufacturer: Texas Instruments; PackageTopMarking: NSUZXYTTE#*LM2678*S-5.0; PowerWise: N; PackageReference: KTW0007B; RoHS: Y; ComponentLink1URL: http://www.ti.com/general/docs/lit/getliterature.tsp?genericPartNumber=LM2678&fileType=pdf; ComponentLink1Description: Datasheet URL; PackageDescription: TO-263, Molded, .400 x .390 x .180in Body, 7 Lead, .050in Pitch, Surface Mount; Code_JEDEC: MO-169-AC; PinCount: 7; CompType: Switcher
U2 = CMP-1557-00012-2: SENSOR CURRENT HALL 12.5A AC/DC; Number of Channels: 1; Min Supply Voltage: 3V; Sensitivity: 110mV/A; Response Time: 4.6us; Operating Supply Voltage: 3.3V; Max Supply Voltage: 5.5V; Max Supply Current: 5.5mA; Bandwidth: 100kHz; Linearity: 1%; Quiescent Current: 4mA; Accuracy: 5%; Polarity: Bidirectional; Case/Package: SOIC; Packaging: Tape and Reel; Number of Pins: 8; Width: 3.9mm; Frequency: 100kHz; -3db Bandwidth: 100kHz; REACH SVHC: No SVHC; Series: -; Height: 1.5mm; Package Quantity: 1; Min Operating Temperature: -40°C; Max Operating Temperature: 125°C; Current Sensing: 12.5A; RoHS Compliant: Yes; Length: 4.9mm

## Sheet MCP2518_PINOUT.SchDoc
size A4; SheetNumber: 4; SheetTotal: 7
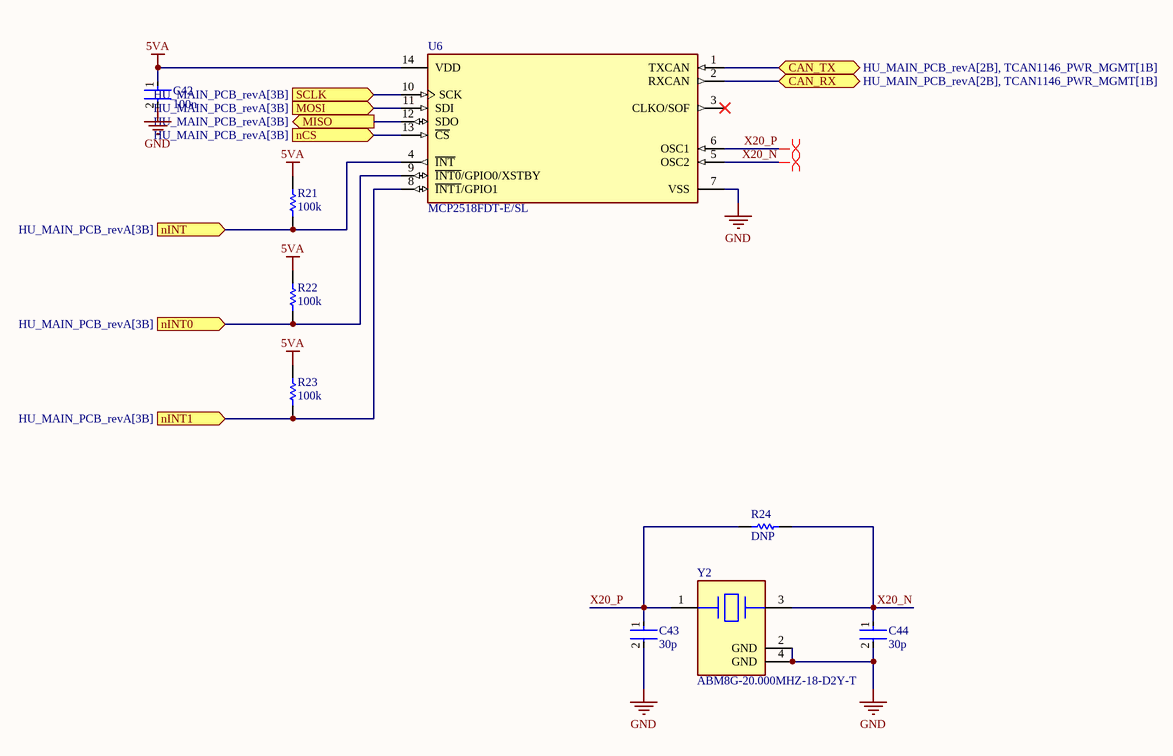
[diagram p4: MCP2518_PINOUT.SchDoc]

### Parts
C42  100n  [FP-0402-L_1_0_0_05-W_0_5-IPC_A]
C43  30p  [FP-0402-L_1_0_0_05-W_0_5-IPC_A]
C44  30p  [FP-0402-L_1_0_0_05-W_0_5-IPC_A]
R21  100k  [R0603B]
R22  100k  [R0603B]
R23  100k  [R0603B]
R24  DNP  [R0603B]
U6  MCP2518FDT-E/SL  [FP-C04-065-SL-IPC_C]
Y2  ABM8G-20.000MHZ-18-D2Y-T  [FP-ABM8G-MFG]

### Ports
CAN_RX (bidir, see HU_MAIN_PCB_revA[2B], TCAN1146_PWR_MGMT[1B]), CAN_TX (bidir, see HU_MAIN_PCB_revA[2B], TCAN1146_PWR_MGMT[1B]), MISO (out, see HU_MAIN_PCB_revA[3B]), MOSI (in, see HU_MAIN_PCB_revA[3B]), nCS (in, see HU_MAIN_PCB_revA[3B]), nINT0 (in, see HU_MAIN_PCB_revA[3B]), nINT1 (in, see HU_MAIN_PCB_revA[3B]), nINT (in, see HU_MAIN_PCB_revA[3B]), SCLK (in, see HU_MAIN_PCB_revA[3B])

### Nets
5VA: C42.1 R21.1 R22.1 R23.1 U6.14(VDD)
GND: C42.2 C43.2 C44.2 U6.7(VSS) Y2.2(GND) Y2.4(GND)
CAN_MISO: U6.12(SDO) ; port MISO
CAN_MOSI: U6.11(SDI) ; port MOSI
CAN_RX: U6.2(RXCAN) ; port CAN_RX
CAN_SCLK: U6.10(SCK) ; port SCLK
CAN_TX: U6.1(TXCAN) ; port CAN_TX
MCP2518_nCS: U6.13(~{CS}) ; port nCS
MCP2518_nINT: R21.2 U6.4(~{INT}) ; port nINT
MCP2518_nINT0: R22.2 U6.9(~{INT0}/GPIO0/XSTBY) ; port nINT0
MCP2518_nINT1: R23.2 U6.8(~{INT1}/GPIO1) ; port nINT1
X20_N: C44.1 R24.2 U6.5(OSC2) Y2.3
X20_P: C43.1 R24.1 U6.6(OSC1) Y2.1

Not connected (* = marked no-connect by the designer): U6 3(CLKO/SOF)*

### Layout directives
differential pair: X20_N, X20_P

### Library data of the parts
C42-C44 = CMP-001-00058-1: as C45 on sheet TCAN1146_PWR_MGMT; Min Operating Temperature: -55°C; Mounting Technology: Surface Mount; Pins: 2; Case/Package: 0402; RoHS Compliant: Yes; Max Operating Temperature: 85°C
R21-R24 = CMP-009-00002-14: Resistor; Value: 330
U6 = CMP-06298-000019-1: IC CAN CONTROLLER SPI 14SOIC; RoHS Compliant: Yes
Y2 = CMP-27762-015817-1: Crystal 20MHz ±20ppm (Tol) ±30ppm (Stability) 18pF FUND 80Ω 4-Pin SMD T/R; ESR (Equivalent Series Resistance): 80R; Termination: SMD/SMT; Length: 3.2mm; Packaging: Tape and Reel; Width: 2.5mm; Load Capacitance: 18pF; Height: 1mm; Min Operating Temperature: -40°C; Tolerance: 20ppm; Number of Pins: 4; Depth: 2.5mm; Series: ABM8G; Frequency: 20MHz; Package Quantity: 1000; Frequency Tolerance: 20ppm; Mount: Surface Mount; Max Operating Temperature: 85°C; Case/Package: CSMD; Frequency Stability: 30ppm

## Sheet ADC088S022.SchDoc
size A4; SheetNumber: 6; SheetTotal: 7
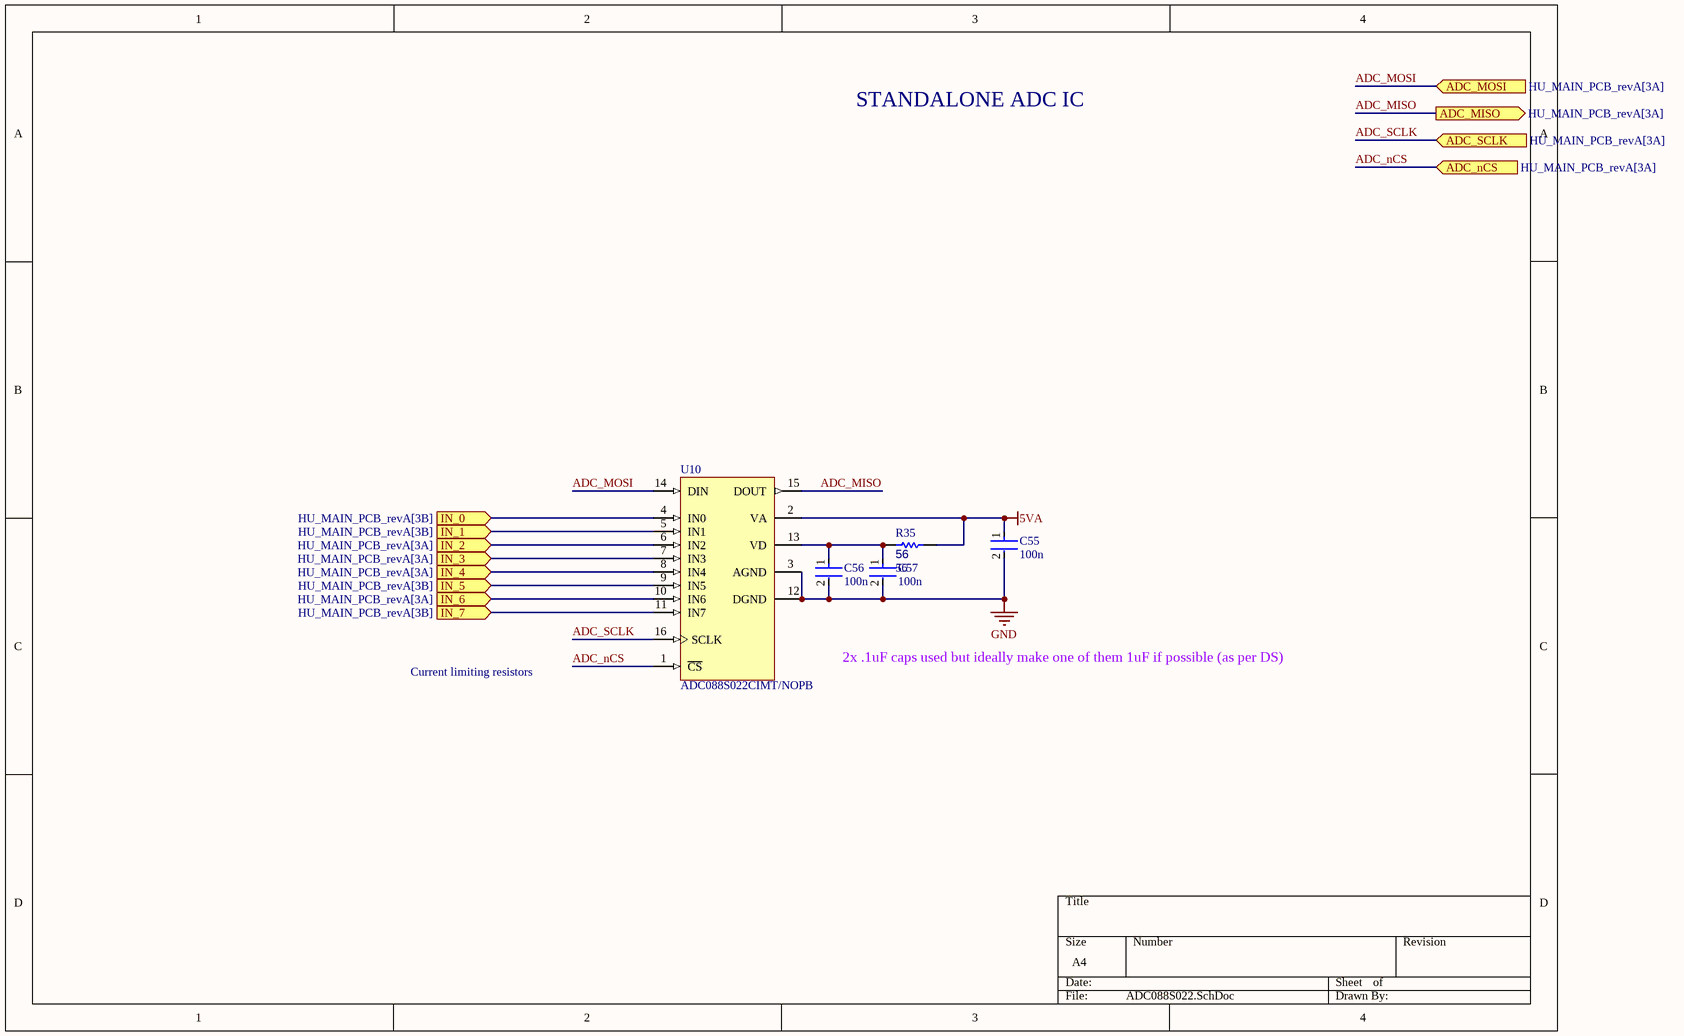
[diagram p5: ADC088S022.SchDoc]

### Parts
C55  100n  [FP-0402-L_1_0_0_05-W_0_5-IPC_A]
C56  100n  [FP-0402-L_1_0_0_05-W_0_5-IPC_A]
C57  100n  [FP-0402-L_1_0_0_05-W_0_5-IPC_A]
R35  56  [R0603B]
U10  ADC088S022CIMT/NOPB  [MTC16_L]

### Ports
ADC_MISO (out, see HU_MAIN_PCB_revA[3A]), ADC_MOSI (in, see HU_MAIN_PCB_revA[3A]), ADC_nCS (in, see HU_MAIN_PCB_revA[3A]), ADC_SCLK (in, see HU_MAIN_PCB_revA[3A]), IN_0 (in, see HU_MAIN_PCB_revA[3B]), IN_1 (in, see HU_MAIN_PCB_revA[3B]), IN_2 (in, see HU_MAIN_PCB_revA[3A]), IN_3 (in, see HU_MAIN_PCB_revA[3A]), IN_4 (in, see HU_MAIN_PCB_revA[3A]), IN_5 (in, see HU_MAIN_PCB_revA[3B]), IN_6 (in, see HU_MAIN_PCB_revA[3A]), IN_7 (in, see HU_MAIN_PCB_revA[3B])

### Nets
5VA: C55.1 R35.1 U10.2(VA)
GND: C55.2 C56.2 C57.2 U10.3(AGND) U10.12(DGND)
ADC_MISO: U10.15(DOUT) ; port ADC_MISO
ADC_MOSI: U10.14(DIN) ; port ADC_MOSI
ADC_nCS: U10.1(~{CS}) ; port ADC_nCS
ADC_SCLK: U10.16(SCLK) ; port ADC_SCLK
NetC56_1: C56.1 C57.1 R35.2 U10.13(VD)
NetR4_5V_REG_0_1: U10.7(IN3) ; port IN_3
NetR4_5V_REG_1_1: U10.10(IN6) ; port IN_6
NetR27_1: U10.4(IN0) ; port IN_0
NetR36_1: U10.5(IN1) ; port IN_1
NetU2_5V_REG_0_7: U10.6(IN2) ; port IN_2
NetU2_5V_REG_1_7: U10.8(IN4) ; port IN_4
NetU7_7: U10.9(IN5) ; port IN_5
NetU10_11: U10.11(IN7) ; port IN_7

### Notes on the sheet
- STANDALONE ADC IC
- Current limiting resistors
- 2x .1uF caps used but ideally make one of them 1uF if possible (as per DS)

### Library data of the parts
C55-C57 = CMP-001-00058-1: as C45 on sheet TCAN1146_PWR_MGMT; Min Operating Temperature: -55°C; Mounting Technology: Surface Mount; Pins: 2; Case/Package: 0402; RoHS Compliant: Yes; Max Operating Temperature: 85°C
R35 = CMP-009-00002-14: Resistor; Value: 56
U10 = CMP-0054-00372-2: 8-Channel, 50 kSPS to 200 kSPS, 8-Bit A/D Converter, 16-pin TSSOP, Pb-Free; Manufacturer: National Semiconductor; PackageTopMarking: NSUZXYTT*88S022*CIMT; CompType: ADC IC; PowerWise: Y; ComponentLink2URL: http://www.national.com/pf/AD/ADC088S022.html; RoHS: Y; PackageDescription: Molded TSSOP, Jedec, 5 x 4.4 x 0.9mm Body, 16 Lead, 0.65mm Pitch; DatasheetVersion: Feb-2010; PinCount: 16; ComponentLink1Description: ADC088S022 Datasheet; Code_JEDEC: MO-153-AB; ComponentLink3URL: http://www.national.com/packaging/folders/mtc16.html; PackageVersion: revD, Jun-2003; ComponentLink3Description: MTC16 Package Page; RevisionNote: Component URLs added; ComponentLink1URL: http://www.national.com/ds/AD/ADC088S022.pdf; ComponentLink2Description: ADC088S022 Web Page; PackageReference: MTC16

## Sheet 3V3_LDO.SchDoc
size A4; SheetNumber: 7; SheetTotal: 7
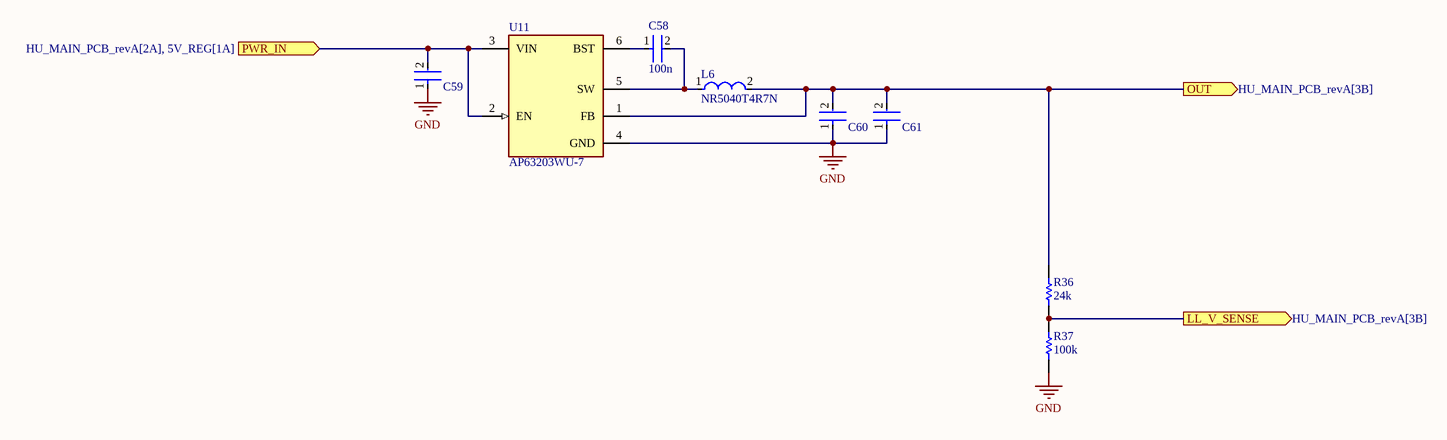
[diagram p6: 3V3_LDO.SchDoc]

### Parts
C58  100n  [FP-0402-L_1_0_0_05-W_0_5-IPC_A]
C59  GRM21BR61E226ME44L  [FP-GRM21B-0_2-e0_2_0_7-IPC_B]  (value not drawn)
C60  GRM21BR61E226ME44L  [FP-GRM21B-0_2-e0_2_0_7-IPC_B]  (value not drawn)
C61  GRM21BR61E226ME44L  [FP-GRM21B-0_2-e0_2_0_7-IPC_B]  (value not drawn)
L6  NR5040T4R7N  [FP-NR5040-H_4_1-MFG]
R36  24k  [R0603B]
R37  100k  [R0603B]
U11  AP63203WU-7  [FP-TSOT26-MFG]

### Ports
LL_V_SENSE (out, see HU_MAIN_PCB_revA[3B]), OUT (out, see HU_MAIN_PCB_revA[3B]), PWR_IN (in, see HU_MAIN_PCB_revA[2A], 5V_REG[1A])

### Nets
3V3: C60.2 C61.2 L6.2 R36.2 U11.1(FB) ; port OUT
GND: C59.1 C60.1 C61.1 R37.1 U11.4(GND)
INT_VCC: C59.2 U11.2(EN) U11.3(VIN) ; port PWR_IN
NetC58_1: C58.1 U11.6(BST)
NetC58_2: C58.2 L6.1 U11.5(SW)
NetR36_1: R36.1 R37.2 ; port LL_V_SENSE

### Library data of the parts
C58 = CMP-001-00058-1: as C45 on sheet TCAN1146_PWR_MGMT; Min Operating Temperature: -55°C; Mounting Technology: Surface Mount; Pins: 2; Case/Package: 0402; RoHS Compliant: Yes; Max Operating Temperature: 85°C
C59-C61 = CMP-2007-03222-3: Chip Multilayer Ceramic Capacitors for General Purpose, 0805, 22uF, X5R, 15%, 20%, 25V; Case/Package: 0805; Depth: 1.25mm; Resistor Type: Ceramic; Voltage Rating: 25V; Lead Free: Lead Free; Voltage Rating (DC): 25V; Case Code (Metric): 2012; Thickness: 0.057inch; REACH SVHC: No SVHC; Material: Ceramic; Tolerance: 20%; Length: 2mm; Capacitance: 22uF; Case Code (Imperial): 0805; Max Operating Temperature: 85°C; Termination: SMD/SMT; Weight: 0.000335oz; Dielectric: X5R; Packaging: Tape and Reel; Voltage: 25V; Package Quantity: 3000; Height: 1.25mm; Mount: Surface Mount; Width: 1.25mm; Min Operating Temperature: -55°C
L6 = CMP-14484-001014-1: SMD Power Inductors 4.7uH ±30% 3.1A 37.7mΩ; Test Frequency: 100kHz; Self Resonant Frequency: 28MHz; DC Resistance (DCR): 37.7mR; Saturation Current: 3.3A; Shielding: Shielded; Core Material: Ferrite; Package Quantity: 1500; RoHS Compliant: Yes; Resistor Type: Wirewound; Width: 4.9mm; Termination: SMD/SMT; Number of Pins: 2; Current Rating: 3.1A; Depth: 5.1mm; RMS Current (Irms): 3.1A; Height - Seated (Max): 0.161inch; Height: 4mm; Packaging: Tape and Reel; Inductance: 4.7uH; Length: 0.193inch; Max DC Current: 3.3A; Inductance Tolerance: 30%; Case/Package: Nonstandard; Series: NR; Min Operating Temperature: -25°C; Max Operating Temperature: 120°C; Mount: Surface Mount; Radiation Hardening: No; Tolerance: 30%; Halogen Free: Halogen Free
R36 R37 = CMP-009-00002-14: Resistor
U11 = CMP-12757-000006-1: IC REG BUCK 3.3V 2A TSOT26; Manufacturer: Diodes Inc.; Output Type: Fixed; Min Supply Voltage: 3.8V; Number Of Outputs: 1; Max Junction Temp: +160°C; Nominal Supply Current: 22uA; Standoff Height: 0.01mm; Switching Frequency: 1.1MHz; Max Supply Voltage: 32V; ComponentLink2Description: Datasheet; Device Class L1: Integrated Circuits (ICs); Temperature: to +160°C; Device Class L3: Voltage Regulators - Switching; RoHS: TRUE; Octopart: https://octopart.com/ap63203wu-7-diodes+inc.-98099550; Output Voltage: 3.3V; Lead Free: Yes; ComponentLink2URL: https://www.diodes.com/assets/Datasheets/AP63200-AP63201-AP63203-AP63205.pdf; Digikey Description: IC REG BUCK 3.3V 2A TSOT26; Footprint Url: https://www.diodes.com/assets/Package-Files/TSOT26.pdf; Ambient Temperature Range High: +85°C; Height: 1mm; Automotive: No; Temperature Range High: +160°C; Switching Topology: Buck; Output Current: 2A; Package: TSOT26; Category: IC; Mouser Description: AP63203 Series 3.3 V 2 A SMT Fixed Low IQ Synchronous Buck - TSOT-26; Device Class L2: Power Management ICs; Ambient Temperature Range Low: -40°C; Manufacturer Part Number: AP63203WU-7

## Nets that join several sheets
3V3: HU_MAIN_PCB_revA (R1.2), TCAN1146_PWR_MGMT (C45.1 C47.1 U7.8 U8.5), 5V_REG_0 (C10_5V_REG_0.2 R2_5V_REG_0.2 U2_5V_REG_0.8), 5V_REG_1 (C10_5V_REG_1.2 U2_5V_REG_1.8), 3V3_LDO (5 pins)
5VA: HU_MAIN_PCB_revA (P1.2 P1.4), TCAN1146_PWR_MGMT (C46.1 U8.3), 5V_REG_1 (R4_5V_REG_1.2 U2_5V_REG_1.3 U2_5V_REG_1.4), MCP2518_PINOUT (5 pins), ADC088S022 (C55.1 R35.1 U10.2)
5VB: HU_MAIN_PCB_revA (F2.2 F3.1 F4.1 F5.2), 5V_REG_0 (R4_5V_REG_0.2 U2_5V_REG_0.3 U2_5V_REG_0.4)
GND: HU_MAIN_PCB_revA (28 pins), TCAN1146_PWR_MGMT (16 pins), 5V_REG_0 (17 pins), 5V_REG_1 (17 pins), MCP2518_PINOUT (6 pins), ADC088S022 (5 pins), 3V3_LDO (5 pins)
INT_VCC: HU_MAIN_PCB_revA (J4.7 J4.8 J5.7 J5.8), TCAN1146_PWR_MGMT (R27.2 U7.3 U7.4), 5V_REG_0 (5 pins), 5V_REG_1 (5 pins), 3V3_LDO (C59.2 U11.2 U11.3)
ADC_MISO: HU_MAIN_PCB_revA (P1.35), ADC088S022 (U10.15)
ADC_MOSI: HU_MAIN_PCB_revA (P1.38), ADC088S022 (U10.14)
ADC_nCS: HU_MAIN_PCB_revA (P1.12), ADC088S022 (U10.1)
ADC_SCLK: HU_MAIN_PCB_revA (P1.40), ADC088S022 (U10.16)
CAN_MISO: HU_MAIN_PCB_revA (P1.21), TCAN1146_PWR_MGMT (U8.6), MCP2518_PINOUT (U6.12)
CAN_MOSI: HU_MAIN_PCB_revA (P1.19), TCAN1146_PWR_MGMT (U8.11), MCP2518_PINOUT (U6.11)
CAN_N: HU_MAIN_PCB_revA (J3.19), TCAN1146_PWR_MGMT (C49.1 D5.1 L5.4 R33.2)
CAN_nCS: HU_MAIN_PCB_revA (P1.26), TCAN1146_PWR_MGMT (U8.14)
CAN_P: HU_MAIN_PCB_revA (J3.18), TCAN1146_PWR_MGMT (C51.2 D5.2 L5.1 R34.1)
CAN_RX: TCAN1146_PWR_MGMT (U8.4), MCP2518_PINOUT (U6.2)
CAN_SCLK: HU_MAIN_PCB_revA (P1.23), TCAN1146_PWR_MGMT (U8.8), MCP2518_PINOUT (U6.10)
CAN_TX: TCAN1146_PWR_MGMT (U8.1), MCP2518_PINOUT (U6.1)
MCP2518_nCS: HU_MAIN_PCB_revA (P1.24), MCP2518_PINOUT (U6.13)
MCP2518_nINT: HU_MAIN_PCB_revA (P1.15), MCP2518_PINOUT (R21.2 U6.4)
MCP2518_nINT0: HU_MAIN_PCB_revA (P1.13), MCP2518_PINOUT (R22.2 U6.9)
MCP2518_nINT1: HU_MAIN_PCB_revA (P1.11), MCP2518_PINOUT (R23.2 U6.8)
NetR1_1: HU_MAIN_PCB_revA (R1.1 R38.1), 5V_REG_1 (R2_5V_REG_1.2)
NetR4_5V_REG_0_1: 5V_REG_0 (R4_5V_REG_0.1 R5_5V_REG_0.2), ADC088S022 (U10.7)
NetR4_5V_REG_1_1: 5V_REG_1 (R4_5V_REG_1.1 R5_5V_REG_1.2), ADC088S022 (U10.10)
NetR27_1: TCAN1146_PWR_MGMT (R27.1 R29.2), ADC088S022 (U10.4)
NetR36_1: ADC088S022 (U10.5), 3V3_LDO (R36.1 R37.2)
NetU2_5V_REG_0_7: 5V_REG_0 (U2_5V_REG_0.7), ADC088S022 (U10.6)
NetU2_5V_REG_1_7: 5V_REG_1 (U2_5V_REG_1.7), ADC088S022 (U10.8)
NetU7_7: TCAN1146_PWR_MGMT (U7.7), ADC088S022 (U10.9)
RAW_PWR: HU_MAIN_PCB_revA (J3.16 J3.17), TCAN1146_PWR_MGMT (XF1.1 XF1.2)